# EAGLE board untitled (EAGLE 9.6.2), part 1 of 4
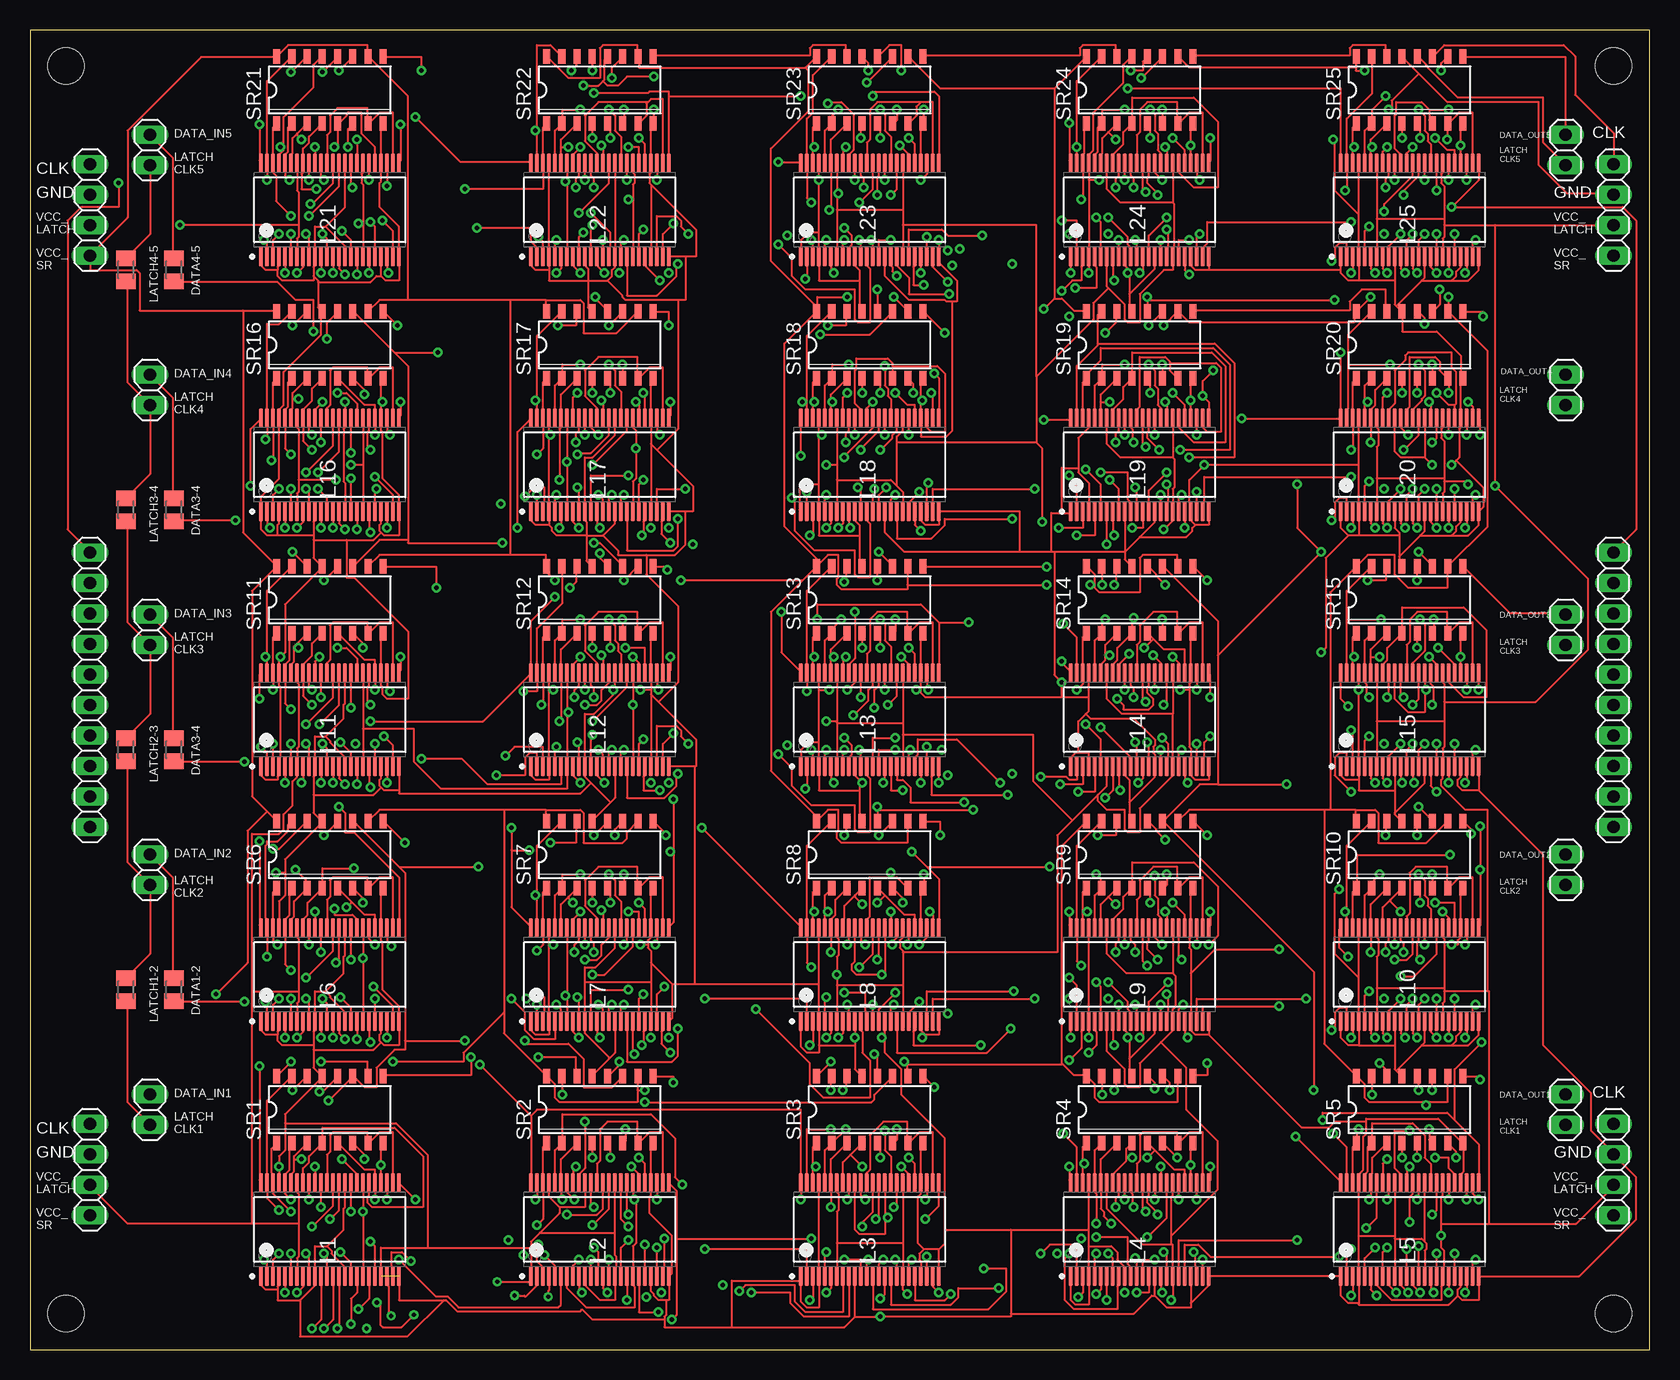
[diagram p3: board, top side]
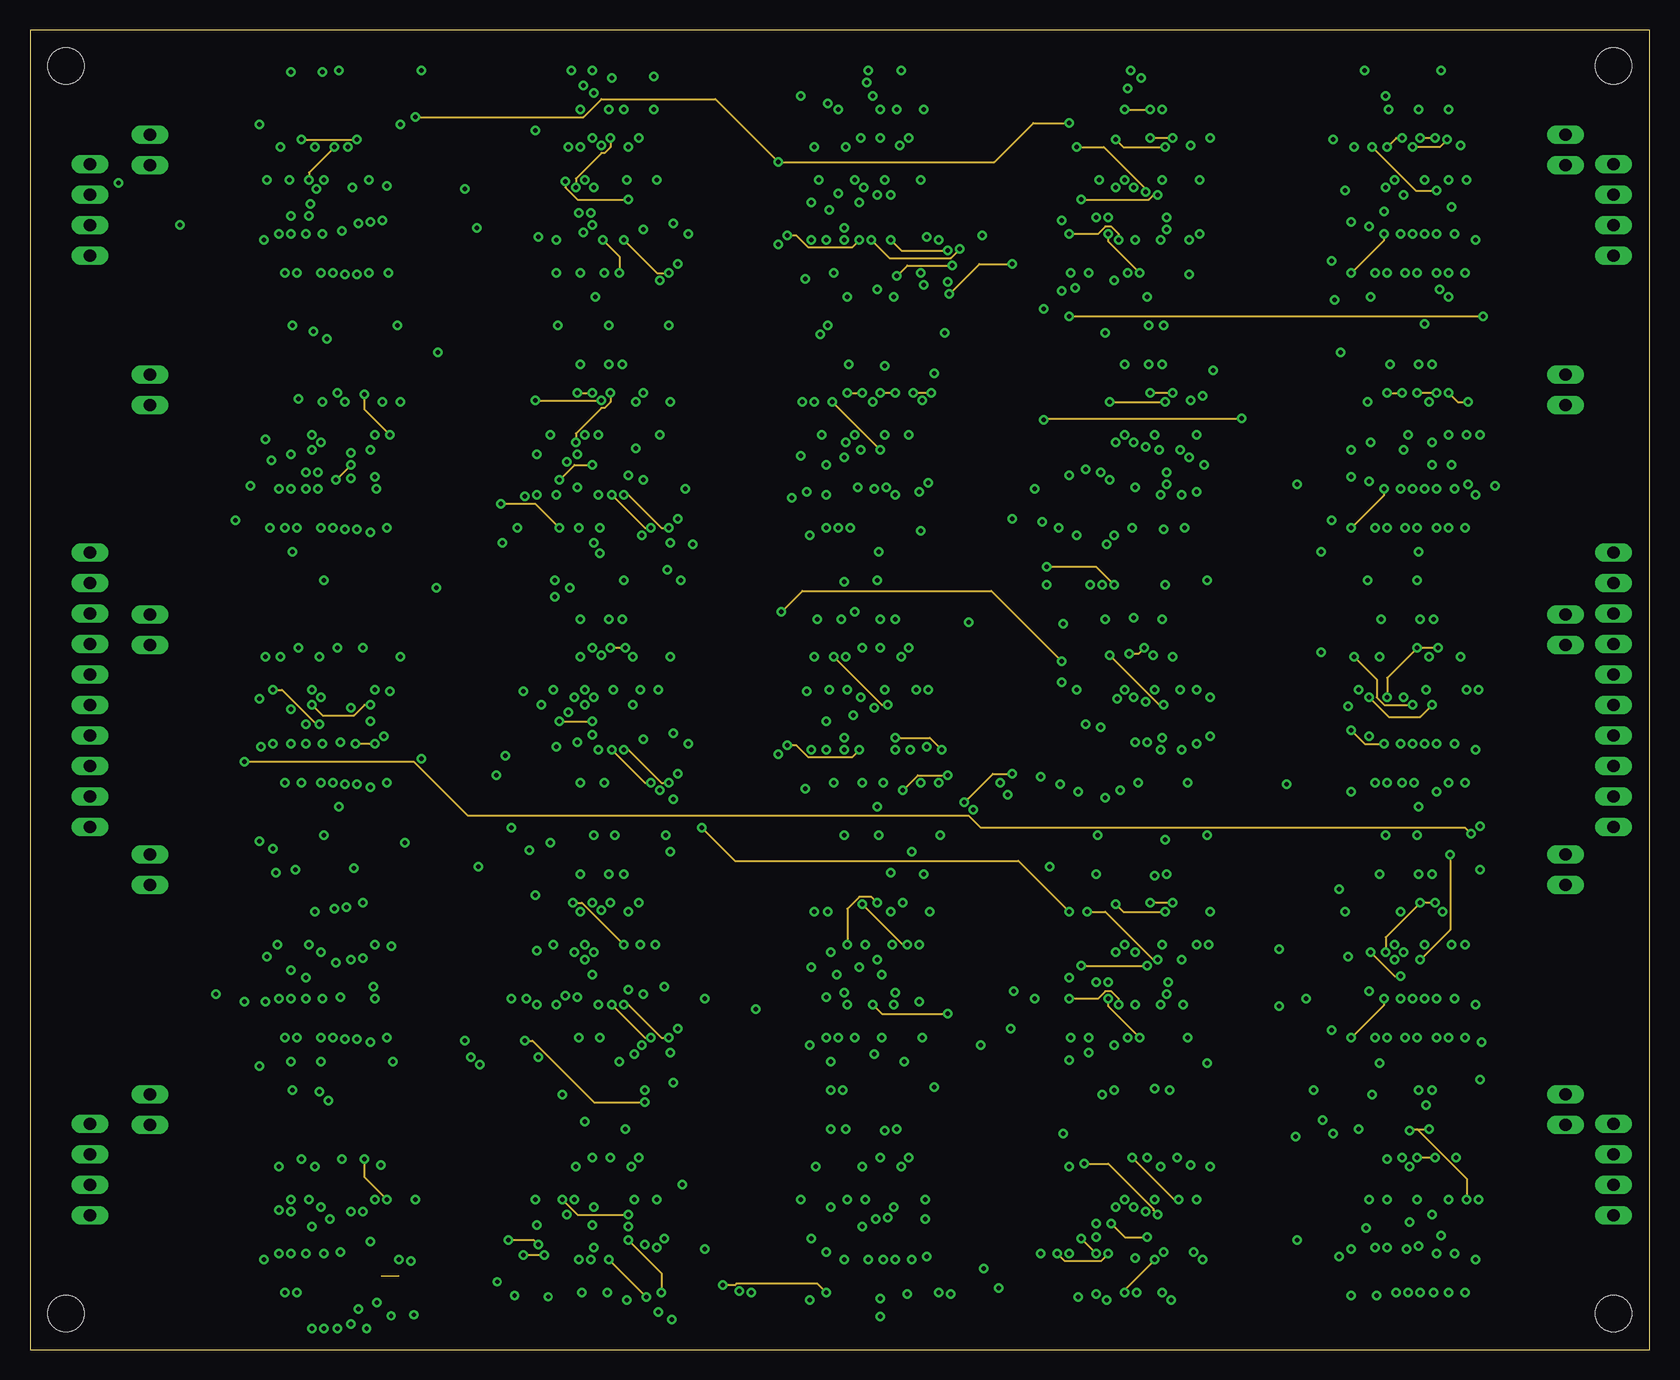
[diagram p4: board, inner layer Route2]
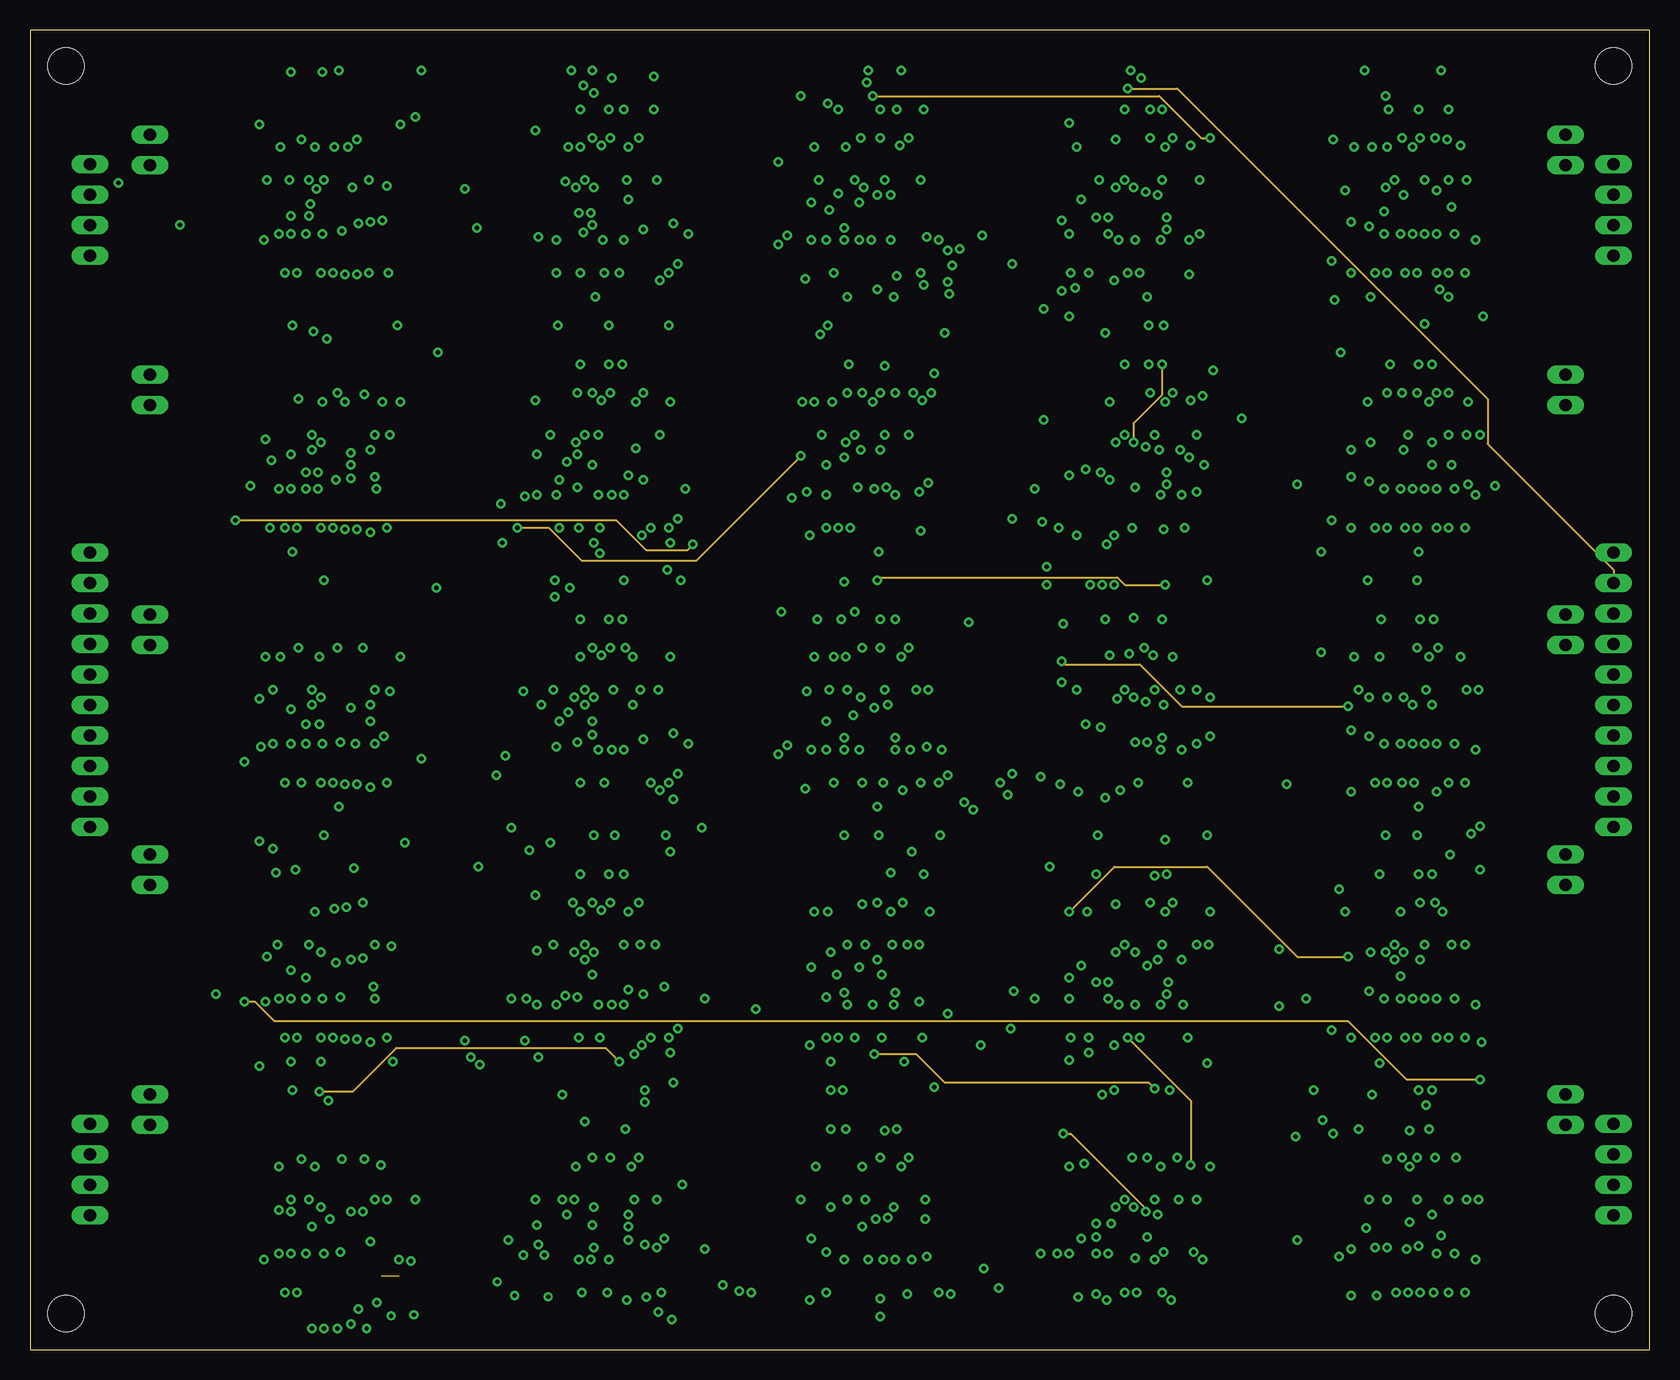
[diagram p5: board, inner layer Route15]
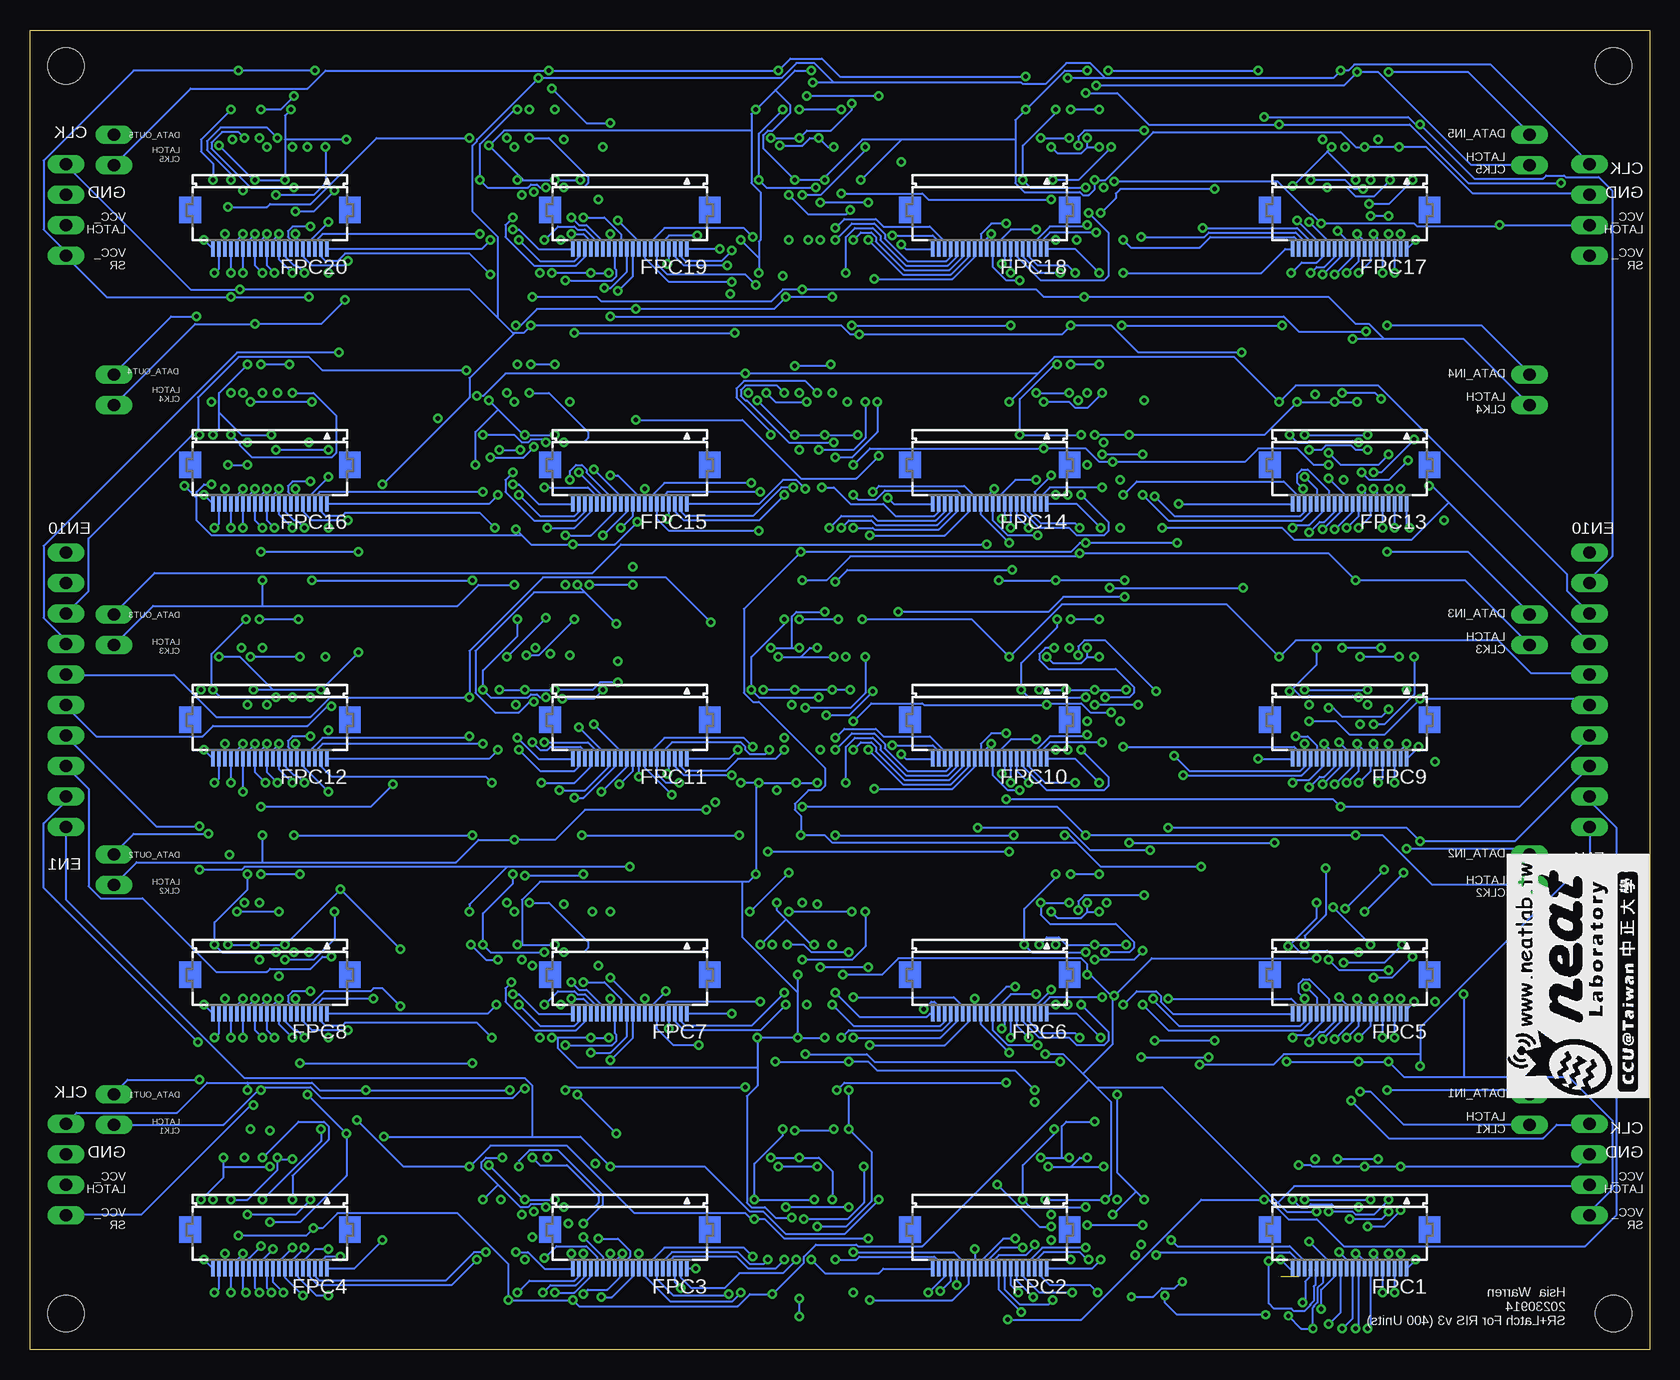
[diagram p6: board, bottom side, seen from below]

Size 135 x 110 mm. Coordinates in mm from the lower left corner, seen from the top.
Outline: 0,0 135,0 135,110 0,110 0,0
Copper layers (1+2*15+16): Top 0.035mm / dielectric 1.5mm / Route2 0.035mm / dielectric 0.15mm / Route15 0.035mm / dielectric 0.2mm / Bottom 0.035mm
Design rules "default *": minimum track width 6mil, minimum drill 0.35mm, track to track 6mil, track to pad 6mil, pad to pad 6mil, via to via 6mil, smd to smd 6mil, copper to edge 40mil, drill to drill 6mil, minimum pad ring 10mil, minimum via ring 8mil, stop-mask expansion 4mil, vias tented up to drill 0mil, thermal gap 10mil
Holes 3 mm at 3,3 132,107 3,107 132,3

## Footprints (pad centres in the part's own frame; a part is rotated, then mirrored left to right if it is on the bottom)
M0805 = smd 1.3 x 1.6: 1 -0.95,0; 2 0.95,0
1X10 = drill 1.016 long: 1 -11.43,0; 2 -8.89,0; 3 -6.35,0; 4 -3.81,0; 5 -1.27,0; 6 1.27,0; 7 3.81,0; 8 6.35,0; 9 8.89,0; 10 11.43,0
FH12-20S-0.5SH = smd 0.3 x 1.3: 1 -4.75,3.25; 2 -4.25,3.25; 3 -3.75,3.25; 4 -3.25,3.25; 5 -2.75,3.25; 6 -2.25,3.25; 7 -1.75,3.25; 8 -1.25,3.25; 9 -0.75,3.25; 10 -0.25,3.25; 11 0.25,3.25; 12 0.75,3.25; 13 1.25,3.25; 14 1.75,3.25; 15 2.25,3.25; 16 2.75,3.25; 17 3.25,3.25; 18 3.75,3.25; 19 4.25,3.25; 20 4.75,3.25
1X02 = drill 1.016 long: 1 -1.27,0; 2 1.27,0
TEXAS_INSTRUMENTS_SN74LVC16373A_2 = smd 1.6 x 0.3: 1 -3.9,5.75; 2 -3.9,5.25; 3 -3.9,4.75; 4 -3.9,4.25; 5 -3.9,3.75; 6 -3.9,3.25; 7 -3.9,2.75; 8 -3.9,2.25; 9 -3.9,1.75; 10 -3.9,1.25; 11 -3.9,0.75; 12 -3.9,0.25; 13 -3.9,-0.25; 14 -3.9,-0.75; 15 -3.9,-1.25; 16 -3.9,-1.75; 17 -3.9,-2.25; 18 -3.9,-2.75; 19 -3.9,-3.25; 20 -3.9,-3.75; 21 -3.9,-4.25; 22 -3.9,-4.75; 23 -3.9,-5.25; 24 -3.9,-5.75; 25 3.9,-5.75; 26 3.9,-5.25; 27 3.9,-4.75; 28 3.9,-4.25; 29 3.9,-3.75; 30 3.9,-3.25; 31 3.9,-2.75; 32 3.9,-2.25; 33 3.9,-1.75; 34 3.9,-1.25; 35 3.9,-0.75; 36 3.9,-0.25; 37 3.9,0.25; 38 3.9,0.75; 39 3.9,1.25; 40 3.9,1.75; 41 3.9,2.25; 42 3.9,2.75; 43 3.9,3.25; 44 3.9,3.75; 45 3.9,4.25; 46 3.9,4.75; 47 3.9,5.25; 48 3.9,5.75
1X04 = drill 1.016 long: 1 -3.81,0; 2 -1.27,0; 3 1.27,0; 4 3.81,0
SO16 = smd 0.6 x 1.2: 1 -4.445,-2.8; 2 -3.175,-2.8; 3 -1.905,-2.8; 4 -0.635,-2.8; 5 0.635,-2.8; 6 1.905,-2.8; 7 3.175,-2.8; 8 4.445,-2.8; 9 4.445,2.8; 10 3.175,2.8; 11 1.905,2.8; 12 0.635,2.8; 13 -0.635,2.8; 14 -1.905,2.8; 15 -3.175,2.8; 16 -4.445,2.8

## Placement (x,y rotation side)
CONNECTION_BETWEEN_SR5-6  0R  [M0805]  12,30 270 top
CONNECTION_BETWEEN_SR10-11  0R  [M0805]  12,50 270 top
CONNECTION_BETWEEN_SR15-16  0R  [M0805]  12,70 270 top
CONNECTION_BETWEEN_SR20-21  0R  [M0805]  12,90 270 top
EN_JP1  [1X10]  5,55 90 top
EN_JP2  [1X10]  132,55 90 top
FPC1  FH12-20S-0.5SH  [FH12-20S-0.5SH]  25,10 180 bottom
FPC2  FH12-20S-0.5SH  [FH12-20S-0.5SH]  55,10 180 bottom
FPC3  FH12-20S-0.5SH  [FH12-20S-0.5SH]  85,10 180 bottom
FPC4  FH12-20S-0.5SH  [FH12-20S-0.5SH]  115,10 180 bottom
FPC5  FH12-20S-0.5SH  [FH12-20S-0.5SH]  25,31.25 180 bottom
FPC6  FH12-20S-0.5SH  [FH12-20S-0.5SH]  55,31.25 180 bottom
FPC7  FH12-20S-0.5SH  [FH12-20S-0.5SH]  85,31.25 180 bottom
FPC8  FH12-20S-0.5SH  [FH12-20S-0.5SH]  115,31.25 180 bottom
FPC9  FH12-20S-0.5SH  [FH12-20S-0.5SH]  25,52.5 180 bottom
FPC10  FH12-20S-0.5SH  [FH12-20S-0.5SH]  55,52.5 180 bottom
FPC11  FH12-20S-0.5SH  [FH12-20S-0.5SH]  85,52.5 180 bottom
FPC12  FH12-20S-0.5SH  [FH12-20S-0.5SH]  115,52.5 180 bottom
FPC13  FH12-20S-0.5SH  [FH12-20S-0.5SH]  25,73.75 180 bottom
FPC14  FH12-20S-0.5SH  [FH12-20S-0.5SH]  55,73.75 180 bottom
FPC15  FH12-20S-0.5SH  [FH12-20S-0.5SH]  85,73.75 180 bottom
FPC16  FH12-20S-0.5SH  [FH12-20S-0.5SH]  115,73.75 180 bottom
FPC17  FH12-20S-0.5SH  [FH12-20S-0.5SH]  25,95 180 bottom
FPC18  FH12-20S-0.5SH  [FH12-20S-0.5SH]  55,95 180 bottom
FPC19  FH12-20S-0.5SH  [FH12-20S-0.5SH]  85,95 180 bottom
FPC20  FH12-20S-0.5SH  [FH12-20S-0.5SH]  115,95 180 bottom
IN_JP1  [1X02]  10,20 90 top
IN_JP2  [1X02]  10,40 90 top
IN_JP3  [1X02]  10,60 90 top
IN_JP4  [1X02]  10,80 90 top
IN_JP5  [1X02]  10,100 90 top
L1  TEXAS_INSTRUMENTS_SN74LVC16373ATEXAS_INSTRUMENTS_SN74LVC16373A_0_2  [TEXAS_INSTRUMENTS_SN74LVC16373A_2]  25,10 90 top
L2  TEXAS_INSTRUMENTS_SN74LVC16373ATEXAS_INSTRUMENTS_SN74LVC16373A_0_2  [TEXAS_INSTRUMENTS_SN74LVC16373A_2]  47.5,10 90 top
L3  TEXAS_INSTRUMENTS_SN74LVC16373ATEXAS_INSTRUMENTS_SN74LVC16373A_0_2  [TEXAS_INSTRUMENTS_SN74LVC16373A_2]  70,10 90 top
L4  TEXAS_INSTRUMENTS_SN74LVC16373ATEXAS_INSTRUMENTS_SN74LVC16373A_0_2  [TEXAS_INSTRUMENTS_SN74LVC16373A_2]  92.5,10 90 top
L5  TEXAS_INSTRUMENTS_SN74LVC16373ATEXAS_INSTRUMENTS_SN74LVC16373A_0_2  [TEXAS_INSTRUMENTS_SN74LVC16373A_2]  115,10 90 top
L6  TEXAS_INSTRUMENTS_SN74LVC16373ATEXAS_INSTRUMENTS_SN74LVC16373A_0_2  [TEXAS_INSTRUMENTS_SN74LVC16373A_2]  25,31.25 90 top
L7  TEXAS_INSTRUMENTS_SN74LVC16373ATEXAS_INSTRUMENTS_SN74LVC16373A_0_2  [TEXAS_INSTRUMENTS_SN74LVC16373A_2]  47.5,31.25 90 top
L8  TEXAS_INSTRUMENTS_SN74LVC16373ATEXAS_INSTRUMENTS_SN74LVC16373A_0_2  [TEXAS_INSTRUMENTS_SN74LVC16373A_2]  70,31.25 90 top
L9  TEXAS_INSTRUMENTS_SN74LVC16373ATEXAS_INSTRUMENTS_SN74LVC16373A_0_2  [TEXAS_INSTRUMENTS_SN74LVC16373A_2]  92.5,31.25 90 top
L10  TEXAS_INSTRUMENTS_SN74LVC16373ATEXAS_INSTRUMENTS_SN74LVC16373A_0_2  [TEXAS_INSTRUMENTS_SN74LVC16373A_2]  115,31.25 90 top
L11  TEXAS_INSTRUMENTS_SN74LVC16373ATEXAS_INSTRUMENTS_SN74LVC16373A_0_2  [TEXAS_INSTRUMENTS_SN74LVC16373A_2]  25,52.5 90 top
L12  TEXAS_INSTRUMENTS_SN74LVC16373ATEXAS_INSTRUMENTS_SN74LVC16373A_0_2  [TEXAS_INSTRUMENTS_SN74LVC16373A_2]  47.5,52.5 90 top
L13  TEXAS_INSTRUMENTS_SN74LVC16373ATEXAS_INSTRUMENTS_SN74LVC16373A_0_2  [TEXAS_INSTRUMENTS_SN74LVC16373A_2]  70,52.5 90 top
L14  TEXAS_INSTRUMENTS_SN74LVC16373ATEXAS_INSTRUMENTS_SN74LVC16373A_0_2  [TEXAS_INSTRUMENTS_SN74LVC16373A_2]  92.5,52.5 90 top
L15  TEXAS_INSTRUMENTS_SN74LVC16373ATEXAS_INSTRUMENTS_SN74LVC16373A_0_2  [TEXAS_INSTRUMENTS_SN74LVC16373A_2]  115,52.5 90 top
L16  TEXAS_INSTRUMENTS_SN74LVC16373ATEXAS_INSTRUMENTS_SN74LVC16373A_0_2  [TEXAS_INSTRUMENTS_SN74LVC16373A_2]  25,73.75 90 top
L17  TEXAS_INSTRUMENTS_SN74LVC16373ATEXAS_INSTRUMENTS_SN74LVC16373A_0_2  [TEXAS_INSTRUMENTS_SN74LVC16373A_2]  47.5,73.75 90 top
L18  TEXAS_INSTRUMENTS_SN74LVC16373ATEXAS_INSTRUMENTS_SN74LVC16373A_0_2  [TEXAS_INSTRUMENTS_SN74LVC16373A_2]  70,73.75 90 top
L19  TEXAS_INSTRUMENTS_SN74LVC16373ATEXAS_INSTRUMENTS_SN74LVC16373A_0_2  [TEXAS_INSTRUMENTS_SN74LVC16373A_2]  92.5,73.75 90 top
L20  TEXAS_INSTRUMENTS_SN74LVC16373ATEXAS_INSTRUMENTS_SN74LVC16373A_0_2  [TEXAS_INSTRUMENTS_SN74LVC16373A_2]  115,73.75 90 top
L21  TEXAS_INSTRUMENTS_SN74LVC16373ATEXAS_INSTRUMENTS_SN74LVC16373A_0_2  [TEXAS_INSTRUMENTS_SN74LVC16373A_2]  25,95 90 top
L22  TEXAS_INSTRUMENTS_SN74LVC16373ATEXAS_INSTRUMENTS_SN74LVC16373A_0_2  [TEXAS_INSTRUMENTS_SN74LVC16373A_2]  47.5,95 90 top
L23  TEXAS_INSTRUMENTS_SN74LVC16373ATEXAS_INSTRUMENTS_SN74LVC16373A_0_2  [TEXAS_INSTRUMENTS_SN74LVC16373A_2]  70,95 90 top
L24  TEXAS_INSTRUMENTS_SN74LVC16373ATEXAS_INSTRUMENTS_SN74LVC16373A_0_2  [TEXAS_INSTRUMENTS_SN74LVC16373A_2]  92.5,95 90 top
L25  TEXAS_INSTRUMENTS_SN74LVC16373ATEXAS_INSTRUMENTS_SN74LVC16373A_0_2  [TEXAS_INSTRUMENTS_SN74LVC16373A_2]  115,95 90 top
LATCH1-2  0R  [M0805]  8,30 270 top
LATCH2-3  0R  [M0805]  8,50 270 top
LATCH3-4  0R  [M0805]  8,70 270 top
LATCH4-5  0R  [M0805]  8,90 270 top
OUT_JP1  [1X02]  128,20 90 top
OUT_JP2  [1X02]  128,40 90 top
OUT_JP3  [1X02]  128,60 90 top
OUT_JP4  [1X02]  128,80 90 top
OUT_JP5  [1X02]  128,100 90 top
POWER_JP1  [1X04]  5,15 90 top
POWER_JP2  [1X04]  5,95 90 top
POWER_JP3  [1X04]  132,15 90 top
POWER_JP4  [1X04]  132,95 90 top
SR1  74HC595  [SO16]  25,20 0 top
SR2  74HC595  [SO16]  47.5,20 0 top
SR3  74HC595  [SO16]  70,20 0 top
SR4  74HC595  [SO16]  92.5,20 0 top
SR5  74HC595  [SO16]  115,20 0 top
SR6  74HC595  [SO16]  25,41.25 0 top
SR7  74HC595  [SO16]  47.5,41.25 0 top
SR8  74HC595  [SO16]  70,41.25 0 top
SR9  74HC595  [SO16]  92.5,41.25 0 top
SR10  74HC595  [SO16]  115,41.25 0 top
SR11  74HC595  [SO16]  25,62.5 0 top
SR12  74HC595  [SO16]  47.5,62.5 0 top
SR13  74HC595  [SO16]  70,62.5 0 top
SR14  74HC595  [SO16]  92.5,62.5 0 top
SR15  74HC595  [SO16]  115,62.5 0 top
SR16  74HC595  [SO16]  25,83.75 0 top
SR17  74HC595  [SO16]  47.5,83.75 0 top
SR18  74HC595  [SO16]  70,83.75 0 top
SR19  74HC595  [SO16]  92.5,83.75 0 top
SR20  74HC595  [SO16]  115,83.75 0 top
SR21  74HC595  [SO16]  25,105 0 top
SR22  74HC595  [SO16]  47.5,105 0 top
SR23  74HC595  [SO16]  70,105 0 top
SR24  74HC595  [SO16]  92.5,105 0 top
SR25  74HC595  [SO16]  115,105 0 top
U$1  [LOGO_SCALE_2.0]  0,21 90 bottom

## Tracks (layer width: path | path; a pad name or v marks a point on that pad's centre or on a via)
CLK  (via drill 0.35)
  Top 0.152: v25.75,106.62 26.88,107.75 SR21.11 | v48.5,106 48.5,106.88 49.38,107.75 SR22.11 | v69.75,105.62 71.88,107.75 SR23.11 | v92.62,106 94.38,107.75 SR24.11 | 31.25,25.75 31.25,39.75 30.75,40.25 | 31.25,25.75 31.25,25 30.38,25 28.88,23.5 28.88,21.88 27.88,21.88 27,22.75 SR1.11 26.88,22.75 v24.88,20.75 | 30.75,40.25 27,44 SR6.11 | v41.25,25.75 41.25,25.5 44.88,25.5 46.12,24.25 46.12,21.88 48.5,21.88 49.38,22.75 SR2.11 | 31.25,25.75 v36.25,25.75 | v48.75,42.88 48.75,43.38 49.38,44 SR7.11 | 30.75,40.25 v37.38,40.25 | v51.25,20.62 70.12,20.62 70.38,20.88 70.38,21.25 71.88,22.75 SR3.11 | v70.75,42.88 71.88,44 SR8.11 | v95,21.62 95,22.25 94.5,22.75 SR4.11 | v116.88,21.62 116.88,22.75 SR5.11 | 99,47.12 97.5,47.12 94.5,44.12 SR9.11 94.5,44 107,31.5 v107,21.62 | 99,57.88 99,60.75 94.5,65.25 SR14.11 | 99,57.88 99,47.12 | v115.75,45.25 116.88,44.12 SR10.11 | 99,47.12 v104.75,47.12 | v115.75,66.5 116.88,65.38 SR15.11 | 99,57.88 v107.62,66.5 105.62,68.5 v105.62,72.12 | v117.5,88.38 117.5,87.12 117,86.62 SR20.11 | SR25.11 117,107.88 117.88,108.75 127.85,108.75 128.8,107.8 128.8,104.6 132,101.4 POWER_JP4.4 | 31.5,67.5 29.12,67.5 27,65.38 SR11.11 | 31.5,67.5 31.5,82 30.38,83.12 | 30.38,83.12 27,86.5 SR16.11 | v47,67.25 47.5,67.25 49.38,65.38 SR12.11 | v39.38,67.25 31.5,67.25 31.5,67.5 | v70.75,66.5 71.88,65.38 SR13.11 | v48.25,85.38 49.38,86.5 SR17.11 | 30.38,83.12 v34,83.12 | v65.88,84.62 70,84.62 71.88,86.5 SR18.11 | v93.25,85.38 94.38,86.5 SR19.11
  Route2 0.152: v51.25,20.62 47,20.62 41.88,25.75 v41.25,25.75
  Bottom 0.152: POWER_JP2.4 5,98.88 13.25,107.12 24.62,107.12 25.12,106.62 v25.75,106.62 26.38,106 45.38,106 | 45.38,106 v48.5,106 | 68,105.62 52.38,105.62 52.25,105.5 50.38,105.5 48.62,107.25 46.62,107.25 45.38,106 | 68,105.62 v69.75,105.62 | 68,105.62 69.62,107.25 71.12,107.25 72.38,106 v92.62,106 97.75,100.88 97.75,100.75 98.12,100.38 98.12,94.88 96,92.75 96,86 | v36.25,25.75 v41.25,25.75 | v48.75,42.88 48.38,42.88 47.75,42.25 | 47.75,42.25 45.75,40.25 v37.38,40.25 | 47.75,42.25 68.12,42.25 68.75,42.88 v70.75,42.88 70.75,44.5 71.25,45 71.25,45.5 70.12,46.62 69.12,46.62 68.75,47 68.75,48.5 74.25,54 74.75,54 75.5,54.75 75.5,61.75 v70.75,66.5 48.25,66.5 47.5,67.25 v47,67.25 v39.38,67.25 | v24.88,20.75 21.75,17.62 8.88,17.62 7.75,18.75 5,18.75 POWER_JP1.4 | v95,21.62 v107,21.62 110.88,21.62 111.5,22.25 116.88,22.25 | 116.88,22.25 120.25,22.25 122.75,19.75 131.12,19.75 132,18.88 POWER_JP3.4 | 116.88,22.25 v116.88,21.62 | v115.75,45.25 106.62,45.25 v104.75,47.12 | v107.62,66.5 v115.75,66.5 | POWER_JP4.4 132,98.75 121.62,88.38 v117.5,88.38 98.38,88.38 96,86 | v34,83.12 42.62,83.12 44.88,85.38 v48.25,85.38 49,84.62 v65.88,84.62 66.62,84.62 67.38,85.38 v93.25,85.38 93.88,84.75 94.62,84.75 | 96,86 94.75,84.75 94.62,84.75 | v105.62,72.12 98.38,79.38 98.38,81 94.62,84.75
DATA_IN1  (via drill 0.35)
  Top 0.152: v21.88,21.62 23,22.75 SR1.14
  Bottom 0.152: v21.88,21.62 10.25,21.62 10,21.38 IN_JP1.2
DATA_IN2  (via drill 0.35)
  Top 0.152: v20.25,41.75 20.75,41.75 23,44 SR6.14 | CONNECTION_BETWEEN_SR5-6.1 12,31 11.88,31.12 11.88,39.38 10,41.25 IN_JP2.2
  Bottom 0.152: v20.25,41.75 10.38,41.75 10,41.38 IN_JP2.2
DATA_IN3  (via drill 0.35)
  Top 0.152: v21.88,66.5 23,65.38 SR11.14 | CONNECTION_BETWEEN_SR10-11.1 12,51 11.88,51.12 11.88,59.38 10,61.25 IN_JP3.2
  Bottom 0.152: v21.88,66.5 15.12,66.5 10,61.38 IN_JP3.2
DATA_IN4  (via drill 0.35)
  Top 0.152: v21.88,85.38 23,86.5 SR16.14 | CONNECTION_BETWEEN_SR15-16.1 12,71 11.88,71.12 11.88,79.38 10,81.25 IN_JP4.2
  Bottom 0.152: v21.88,85.38 14,85.38 10,81.38 IN_JP4.2
DATA_IN5  (via drill 0.35)
  Top 0.152: v21.75,106.5 23,107.75 SR21.14 | CONNECTION_BETWEEN_SR20-21.1 12,91 11.88,91.12 11.88,99.38 10,101.25 IN_JP5.2
  Bottom 0.152: v21.75,106.5 15.12,106.5 10,101.38 IN_JP5.2
DATA_OUT1  (via drill 0.35)
  Top 0.152: v120.88,22.5 120.88,22.75 119.5,22.75 SR5.9 | v17.88,29 12,29 CONNECTION_BETWEEN_SR5-6.2
  Route15 0.152: v17.88,29 18.75,29 20.38,27.38 109.88,27.38 114.75,22.5 v120.88,22.5
  Bottom 0.152: v120.88,22.5 126.88,22.5 128,21.38 OUT_JP1.2
DATA_OUT2  (via drill 0.35)
  Top 0.152: v120.12,43 120.12,43.38 119.5,44 SR10.9 | v17.88,49 12,49 CONNECTION_BETWEEN_SR10-11.2
  Route2 0.152: v17.88,49 32,49 36.5,44.5 78.25,44.5 79.25,43.5 119.62,43.5 v120.12,43
  Bottom 0.152: v120.12,43 126.38,43 128,41.38 OUT_JP2.2
DATA_OUT3  (via drill 0.35)
  Top 0.152: SR15.9 119.5,65.25 123.38,61.38 128,61.38 OUT_JP3.2 | v17.12,69.12 12,69.12 CONNECTION_BETWEEN_SR15-16.2
  Route15 0.152: v17.12,69.12 48.88,69.12 51.38,66.62 54.75,66.62 v55.25,67.12
  Bottom 0.152: v55.25,67.12 85.75,67.12 88.12,64.75 124.62,64.75 128,61.38 OUT_JP3.2
DATA_OUT4  (via drill 0.35)
  Top 0.152: v121.12,86.12 121.12,86.5 119.5,86.5 SR20.9 | v23.62,84.88 23.62,87.5 22.12,87.5 20.62,89 12,89 CONNECTION_BETWEEN_SR20-21.2
  Route2 0.152: v121.12,86.12 v86.62,86.12
  Bottom 0.152: v121.12,86.12 123.25,86.12 128,81.38 OUT_JP4.2 | v23.62,84.88 29.25,84.88 30.5,86.12 v86.62,86.12
DATA_OUT5
  Top 0.152: OUT_JP5.2 128,107.75 119.5,107.75 SR25.9
EN1  (via drill 0.35)
  Top 0.152: v86.62,15.25 86.62,14.12 86.75,14 L4.48 | v105.5,17.75 109.25,14 L5.48 | 41.75,19.5 L2.48 | 41.75,19.5 42.25,20 64.25,20 L3.48 v64.25,12.5 | v19.12,23.62 19.12,14.12 19.25,14 L1.48 | v37.5,23.75 41.75,19.5
  Bottom 0.152: v105.5,17.75 93.12,17.75 | 93.12,17.75 89.12,17.75 v86.62,15.25 78.75,15.25 75,11.5 73.88,11.5 72,9.62 67.12,9.62 v64.25,12.5 | EN_JP2.1 132,37.5 117.12,22.62 93.75,22.62 93.12,22 93.12,17.75 | 19.12,24.62 19.12,26.88 5,41 EN_JP1.1 | 19.12,24.62 v19.12,23.62 | v37.5,23.75 31.38,23.75 30.5,24.62 19.12,24.62
EN2  (via drill 0.35)
  Top 0.152: v32.12,12.5 30.75,13.88 L1.25 | v53.5,2.5 53.88,2.88 53.88,9.25 | 53.88,9.25 53.88,13.25 53.25,13.88 L2.25 | L3.25 75.75,12 v74.62,10.88 | 53.88,9.25 v65.12,9.25 | v98.38,15.25 98.38,14.12 98.25,14 L4.25 | L5.25 120.75,17.12 118.75,19.12 | 118.75,19.12 118.12,19.75 107.75,19.75 v107.75,19.12 | v121,25.62 118.75,23.38 118.75,19.12
  Bottom 0.152: v53.5,2.5 47.38,2.5 37.38,12.5 v32.12,12.5 31.75,12.5 30.12,10.88 27.75,10.88 25.5,8.62 5.38,8.62 2.75,11.25 2.75,43.5 5,45.75 EN_JP1.2 | v65.12,9.25 72.12,9.25 73.75,10.88 v74.62,10.88 74.88,10.88 75.38,11.38 84.62,11.38 90.25,17 96.62,17 v98.38,15.25 103.88,15.25 v107.75,19.12 | EN_JP2.2 132,45.75 133.88,43.88 133.88,38.5 v121,25.62
EN3  (via drill 0.35)
  Top 0.152: v109.88,32.75 109.12,33.5 109.12,35 109.25,35.12 L10.48 | v19.12,42.38 19.12,35.38 19.25,35.25 L6.48 | v40.12,43.5 40.12,41.62 | 40.12,41.62 40.12,36.88 41.75,35.25 L7.48 | v56,43.5 64.25,35.25 L8.48 | 40.12,41.62 v41.62,41.62 | v86.62,36.5 86.62,35.38 86.75,35.25 L9.48
  Route2 0.152: v86.62,36.5 82.38,40.75 58.75,40.75 v56,43.5
  Route15 0.152: v109.88,32.75 105.62,32.75 98.12,40.25 90.38,40.25 v86.62,36.5
  Bottom 0.152: v109.88,32.75 110.62,32.75 111.62,31.75 115,31.75 115.25,31.5 119.5,31.5 125.62,37.62 129.12,37.62 130.12,38.62 130.12,46.75 132,48.62 EN_JP2.3 | EN_JP1.3 5,48.62 11.25,42.38 v19.12,42.38 20.25,43.5 v40.12,43.5 | v56,43.5 48.5,43.5 46.62,41.62 v41.62,41.62
EN4  (via drill 0.35)
  Top 0.152: v120.88,43.62 v120.88,40 120.88,35.38 120.75,35.25 L10.25 | L6.25 30.75,39.38 27,43.12 26.25,43.12 26.25,44.75 v25.75,45.25 | v53.62,45.88 53.62,41.5 | 53.62,41.5 53.62,35.62 53.25,35.25 L7.25 | L8.25 75.75,39.25 74.75,40.25 | v73.5,41.5 74.75,40.25 | 53.62,41.5 v53.38,41.5 | v98.38,36.5 98.38,35.38 98.25,35.25 L9.25 | 74.75,40.25 v85,40.25
  Bottom 0.152: v120.88,43.62 124.5,43.62 132,51.12 EN_JP2.4 | EN_JP1.4 5,51.12 10.88,45.25 v25.75,45.25 26.38,45.88 v53.62,45.88 | v53.38,41.5 v73.5,41.5 | v98.38,36.5 98.38,37.12 95.25,40.25 | v85,40.25 95.25,40.25 | v120.88,40 117.38,40 117.12,40.25 95.25,40.25
EN5  (via drill 0.35)
  Top 0.152: L15.48 109.25,54.25 v109.88,53.62 | v19.12,54.25 19.12,56.25 19.25,56.38 L11.48 | v28.38,52.38 37.75,52.38 41.75,56.38 L12.48 41.75,60.75 v43.75,62.75 | v62.62,61.5 62.62,58.12 64.25,56.5 L13.48 | v86,57.38 86,57.25 86.75,56.5 L14.48
  Route2 0.152: v86,57.38 80.12,63.25 64.38,63.25 v62.62,61.5
  Route15 0.152: v109.88,53.62 96,53.62 92.5,57.12 86.25,57.12 v86,57.38
  Bottom 0.152: v109.88,53.62 110.25,53.62 111.88,52 119.75,52 120.62,51.12 129.5,51.12 132,53.62 EN_JP2.5 | EN_JP1.5 5,53.75 5.5,54.25 v19.12,54.25 22.12,51.25 25,51.25 26.12,52.38 v28.38,52.38 | v62.62,61.5 50.12,61.5 48.88,62.75 v43.75,62.75
EN6  (via drill 0.35)
  Top 0.152: v98.38,54.38 98.38,56.25 98.25,56.38 L14.25 | v120.75,55 L15.25 | v30.88,57.75 30.88,56.62 30.75,56.5 L11.25 | v53.38,57.75 53.38,56.62 53.25,56.5 L12.25 | 75.75,60.62 L13.25 | 75.75,60.62 74.25,62.12 65.62,62.12 v65.62,60.88 | 75.75,60.62 v78.25,60.62
  Bottom 0.152: 121.25,54.5 123,56.25 132,56.25 EN_JP2.6 | 121.25,54.5 119.5,52.75 111.62,52.75 110,54.38 v98.38,54.38 98.38,58.25 92.25,64.38 82,64.38 v78.25,60.62 | 121.25,54.5 v120.75,55 | EN_JP1.6 5,56.38 9.88,56.38 12.62,59.12 29.5,59.12 v30.88,57.75 35.25,62.12 49,62.12 v53.38,57.75 56.5,60.88 v65.62,60.88
EN7  (via drill 0.35)
  Top 0.152: v18.38,72 18.38,76.75 19.25,77.62 L16.48 | v40.62,68.5 40.62,76.5 41.75,77.62 L17.48 | v64.25,74.5 L18.48 | v84.5,77.5 86.75,77.5 L19.48 | v101,77.62 109.25,77.62 L20.48 v109.25,83.12
  Route2 0.152: v101,77.62 84.62,77.62 v84.5,77.5
  Route15 0.152: v40.62,68.5 43.25,68.5 46,65.75 55.5,65.75 v64.25,74.5
  Bottom 0.152: v18.38,72 18.12,72 16.75,70.62 | 16.75,70.62 5,58.88 EN_JP1.7 | v40.62,68.5 30.62,68.5 29.62,67.5 19.88,67.5 16.75,70.62 | v64.25,74.5 66.12,72.62 70.75,72.62 75.62,77.5 v84.5,77.5 | EN_JP2.7 132,59.12 133.88,61 133.88,67 117.75,83.12 v109.25,83.12
EN8  (via drill 0.35)
  Top 0.152: v120.88,76.25 120.88,77.5 120.75,77.62 L20.25 | v30.88,79 30.88,77.88 30.75,77.75 L16.25 | v53.38,79 53.38,77.88 53.25,77.75 L17.25 | L18.25 75.75,81 v75.38,81.38 | L19.25 98.25,79 v97.75,79.5 97.75,80.75 v98.62,81.62
  Bottom 0.152: 121,76.25 121.5,76.25 130.12,67.62 130.12,63.25 132,61.38 EN_JP2.8 | EN_JP1.8 5,61.38 6.88,63.25 6.88,64.62 22.62,80.38 29.5,80.38 v30.88,79 34.62,82.75 49.62,82.75 51,81.38 | 51,81.38 v53.38,79 | 51,81.38 v75.38,81.38 95.38,81.38 97.25,79.5 v97.75,79.5 | 121,76.25 121,79.38 117.62,82.75 111.75,82.75 110.62,81.62 v98.62,81.62 | 121,76.25 v120.88,76.25
EN9  (via drill 0.35)
  Top 0.152: v86.62,102.25 86.62,99.12 86.75,99 L24.48 | v91.5,105.12 109.25,105.12 L25.48 | v19.12,102.12 19.12,99.12 19.25,99 L21.48 | v32.12,102.75 35.88,99 41.75,99 L22.48 | v62.38,99 64.25,99 L23.48
  Route2 0.152: v32.12,102.75 46.12,102.75 47.62,104.25 57.12,104.25 v62.38,99 80.38,99 83.62,102.25 v86.62,102.25
  Route15 0.152: EN_JP2.9 132,65 121.5,75.5 121.5,79.25 95.62,105.12 v91.5,105.12
  Bottom 0.152: v86.62,102.25 88.62,102.25 v91.5,105.12 | v32.12,102.75 20.12,102.75 19.5,102.12 v19.12,102.12 14.62,97.62 8.88,97.62 8.62,97.88 7.12,97.88 7,97.75 4.25,97.75 3.12,96.62 3.12,66.12 5,64.25 EN_JP1.9
EN10  (via drill 0.35)
  Top 0.152: v98.38,101 98.38,99.12 98.25,99 L24.25 | L25.25 120.75,97.5 v118.5,95.25 132.75,95.25 133.88,94.12 133.88,68.38 132,66.5 EN_JP2.10 | v30.88,102.12 30.88,99.12 30.75,99 L21.25 | v47,104.75 51.5,104.75 51.62,104.88 53.25,104.88 53.25,104.5 | L22.25 53.25,104.5 | L23.25 75.75,104.5 75.38,104.88 70.25,104.88 v70.25,104.5 | 53.25,104.5 v64.25,104.5 | v7.38,97.25 7.38,95.25 4.25,95.25 3.12,94.12 3.12,68.38 5,66.5 EN_JP1.10
  Route15 0.152: v98.38,101 97.62,101 94.12,104.5 v70.25,104.5
  Bottom 0.152: v98.38,101 106.12,101 111.62,95.5 115,95.5 115.25,95.25 v118.5,95.25 | v47,104.75 44.38,104.75 41.75,102.12 v30.88,102.12 20,102.12 15.12,97.25 v7.38,97.25 | v64.25,104.5 v70.25,104.5
FPC1_1  (via drill 0.35)
  Top 0.152: v19.5,7.5 19.75,7.25 L1.2
  Bottom 0.152: v19.5,7.5 FPC1.1
FPC1_2  (via drill 0.35)
  Top 0.152: v20.75,8 20.25,7.5 L1.3
  Bottom 0.152: v20.75,8 FPC1.2
FPC1_3  (via drill 0.35)
  Top 0.152: L1.5 v21.25,4.75
  Bottom 0.152: v21.25,4.75 FPC1.3
FPC1_4  (via drill 0.35)
  Top 0.152: L1.6 v21.75,8
  Bottom 0.152: v21.75,8 FPC1.4
FPC1_5  (via drill 0.35)
  Top 0.152: v22.25,4.75 22.75,5.25 L1.8
  Bottom 0.152: v22.25,4.75 FPC1.5
FPC1_6  (via drill 0.35)
  Top 0.152: v23,8 23.25,7.75 L1.9
  Bottom 0.152: FPC1.6 22.75,7.75 v23,8
FPC1_7  (via drill 0.35)
  Top 0.152: v23.5,1.75 24.25,2.5 L1.11
  Bottom 0.152: FPC1.7 23.25,2 v23.5,1.75
FPC1_8  (via drill 0.35)
  Top 0.152: v24.5,8 24.75,7.75 L1.12
  Bottom 0.152: FPC1.8 23.75,7.38 24.38,8 v24.5,8
FPC1_9  (via drill 0.35)
  Top 0.152: v24.5,1.75 25.25,2.5 L1.13
  Bottom 0.152: FPC1.9 24.25,2 v24.5,1.75
FPC1_10  (via drill 0.35)
  Top 0.152: v25.62,1.75 25.75,1.88 L1.14
  Bottom 0.152: FPC1.10 24.75,2.62 v25.62,1.75
FPC1_11  (via drill 0.35)
  Top 0.152: v25.88,8.12 26.75,7.25 L1.16
  Bottom 0.152: FPC1.11 25.25,7.5 v25.88,8.12
FPC1_12  (via drill 0.35)
  Top 0.152: L1.17 27.25,4.75 26.75,4.25 v26.75,2.12
  Bottom 0.152: FPC1.12 25.75,3.12 v26.75,2.12
FPC1_13  (via drill 0.35)
  Top 0.152: v27.38,3.38 28.25,4.25 L1.19
  Bottom 0.152: FPC1.13 26.25,6.12 27.38,5 v27.38,3.38
FPC1_14  (via drill 0.35)
  Top 0.152: v28.38,9 28.75,8.62 L1.20
  Bottom 0.152: FPC1.14 26.75,7.38 v28.38,9
FPC1_15  (via drill 0.35)
  Top 0.152: L1.22 29.87,5.98 29.87,5.26 29.9,5.24 29.9,2.9 30,2.8 v30.1,2.8
  Bottom 0.152: FPC1.15 27.25,5.56 27.68,5.13 27.68,3.93 27.98,3.63 27.98,3.57 28.05,3.5 v28.05,1.75 29.05,1.75 v30.1,2.8
FPC1_16  (via drill 0.35)
  Top 0.152: v31.75,7.38 31,8.12 30.12,8.12 30.12,7 30.25,6.88 L1.23
  Bottom 0.152: 27.75,6.12 FPC1.16 27.87,6.63 27.87,5.37 27.98,5.25 27.98,4.05 28.29,3.75 28.29,3.69 28.79,3.19 29.63,3.19 29.85,3.41 31.31,3.41 31.75,3.85 v31.75,7.38
FPC1_17  (via drill 0.35)
  Top 0.152: v28.92,3.92 29.19,3.65 29.19,2.42 29.2,2.42 29.2,2.07 29.4,1.87 30.97,1.87 v32,2.9 | v40.4,4.5 41.2,4.5 41.3,4.4 42.3,5.4 42.3,6.05 L2.2
  Bottom 0.152: FPC1.17 28.37,6.63 28.37,6 28.7,5.68 28.7,4.14 v28.92,3.92 | v40.4,4.5 40.4,3.9 39.4,2.9 v32,2.9
FPC1_18  (via drill 0.35)
  Top 0.152: v42.38,8.75 42.25,8.62 42.25,7.38 42.75,6.88 L2.3
  Route2 0.152: v39.88,9.12 42,9.12 v42.38,8.75
  Bottom 0.152: FPC1.18 28.75,7.38 30,8.62 39.38,8.62 v39.88,9.12
FPC1_19  (via drill 0.35)
  Top 0.152: v42.88,7.88 43.75,7 L2.5
  Route2 0.152: v42.88,7.88 v41.12,7.88
  Bottom 0.152: FPC1.19 29.25,7.38 30,8.12 40.88,8.12 v41.12,7.88
FPC1_20  (via drill 0.35)
  Top 0.152: v30.75,7.5 33.82,4.43 34.8,4.43 35.72,3.52 44.02,3.52 44.25,3.75 L2.6
  Bottom 0.152: FPC1.20 30,6.75 v30.75,7.5
FPC2_1  (via drill 0.35)
  Top 0.152: v45.75,7.5 45.25,7 L2.8
  Bottom 0.152: FPC2.1 46.5,6.75 v45.75,7.5
FPC2_2  (via drill 0.35)
  Top 0.152: v46,4.75 45.75,5 L2.9
  Bottom 0.152: FPC2.2 50.75,6.12 50,5.38 46.62,5.38 v46,4.75
FPC2_3  (via drill 0.35)
  Top 0.152: L2.11 v46.75,7.5
  Bottom 0.152: FPC2.3 51.25,7.38 50.5,8.12 47.5,8.12 46.88,7.5 v46.75,7.5
FPC2_4  (via drill 0.35)
  Top 0.152: v47,8.5 47.38,8.12 47.38,7 47.25,6.88 L2.12
  Bottom 0.152: FPC2.4 51.75,7.38 50.62,8.5 v47,8.5
FPC2_5  (via drill 0.35)
  Top 0.152: v48.12,4.75 47.75,5.12 L2.13
  Bottom 0.152: FPC2.5 52.25,6.12 50.88,4.75 v48.12,4.75
FPC2_6  (via drill 0.35)
  Top 0.152: L2.14 v48.25,7.5
  Route2 0.152: v48.25,7.5 v51.38,4.38
  Bottom 0.152: FPC2.6 52.75,5.75 v51.38,4.38
FPC2_7  (via drill 0.35)
  Top 0.152: v49.88,9.12 49.25,8.5 L2.16
  Route2 0.152: v52.62,4.75 52.62,6.38 v49.88,9.12
  Bottom 0.152: FPC2.7 53.25,5.38 v52.62,4.75
FPC2_8  (via drill 0.35)
  Top 0.152: L2.17 v49.75,4.12
  Bottom 0.152: FPC2.8 53.75,5 52.5,3.75 50.12,3.75 v49.75,4.12
FPC2_9  (via drill 0.35)
  Top 0.152: v52.38,3.12 50.75,3.12 L2.19
  Bottom 0.152: FPC2.9 54.25,5 v52.38,3.12
FPC2_10  (via drill 0.35)
  Top 0.152: L2.20 v51.25,8.75
  Bottom 0.152: FPC2.10 54.75,7.38 54.25,7.88 52,7.88 51.25,8.62 v51.25,8.75
FPC2_11  (via drill 0.35)
  Top 0.152: L2.22 v52.25,8.5
  Bottom 0.152: FPC2.11 55.25,7.38 54.12,8.5 v52.25,8.5
FPC2_12  (via drill 0.35)
  Top 0.152: v52.88,9.25 52.88,7 52.75,6.88 L2.23
  Bottom 0.152: FPC2.12 55.75,7.38 53.88,9.25 v52.88,9.25
FPC2_13  (via drill 0.35)
  Top 0.152: v56.25,8.38 64.75,8.38 L3.2
  Bottom 0.152: v56.25,8.38 FPC2.13
FPC2_14  (via drill 0.35)
  Top 0.152: v65,4.12 65.25,4.38 L3.3
  Bottom 0.152: FPC2.14 56.75,5.5 58.12,4.12 v65,4.12
FPC2_15  (via drill 0.35)
  Top 0.152: v66.38,8.12 66.25,8 L3.5
  Bottom 0.152: FPC2.15 57.25,7.38 58,8.12 v66.38,8.12
FPC2_16  (via drill 0.35)
  Top 0.152: v66.38,4.75 66.75,5.12 L3.6
  Route2 0.152: v57.75,5.38 58.75,5.38 58.88,5.5 65.62,5.5 v66.38,4.75
  Bottom 0.152: v57.75,5.38 FPC2.16
FPC2_17  (via drill 0.35)
  Top 0.152: v59.12,4.88 59.62,5.38 63.75,5.38 63.75,4 64.62,3.12 67.75,3.12 L3.8
  Bottom 0.152: FPC2.17 58.25,5.75 v59.12,4.88
FPC2_18  (via drill 0.35)
  Top 0.152: v60.12,4.75 63.38,4.75 63.38,3.88 64.5,2.75 68.25,2.75 L3.9
  Bottom 0.152: FPC2.18 58.75,6.12 v60.12,4.75
FPC2_19  (via drill 0.35)
  Top 0.152: v67.88,7.5 69.25,7.5 L3.11
  Bottom 0.152: FPC2.19 59.25,7.38 59.62,7.75 65.88,7.75 66.12,7.5 v67.88,7.5
FPC2_20  (via drill 0.35)
  Top 0.152: v69.88,7.5 69.75,7.38 L3.12
  Bottom 0.152: FPC2.20 63.88,6.75 64.25,6.38 68.75,6.38 v69.88,7.5
FPC3_1  (via drill 0.35)
  Top 0.152: v79.5,6.75 81.38,6.75 81.38,4.88 79.88,3.38 70.25,3.38 L3.13
  Bottom 0.152: v79.5,6.75 FPC3.1
FPC3_2  (via drill 0.35)
  Top 0.152: v71.12,7.5 70.75,7.12 L3.14
  Bottom 0.152: FPC3.2 80.75,6 79.88,5.12 77.12,5.12 75.88,6.38 72.25,6.38 v71.12,7.5
FPC3_3  (via drill 0.35)
  Top 0.152: v80.75,5.12 77.38,5.12 77.38,4.38 76.75,3.75 71.75,3.75 L3.16
  Bottom 0.152: FPC3.3 81.25,5.62 v80.75,5.12
FPC3_4  (via drill 0.35)
  Top 0.152: v72.12,7.5 72.25,7.38 L3.17
  Bottom 0.152: FPC3.4 81.75,7.38 81.38,7.75 76.12,7.75 75.12,6.75 72.88,6.75 v72.12,7.5
FPC3_5  (via drill 0.35)
  Top 0.152: v73.5,7.5 73.25,7.25 L3.19
  Bottom 0.152: FPC3.5 82.25,7.38 81.5,8.12 76,8.12 75,7.12 73.88,7.12 v73.5,7.5
FPC3_6  (via drill 0.35)
  Top 0.152: v76.75,4.62 76.25,4.12 73.75,4.12 L3.20
  Bottom 0.152: FPC3.6 82.75,5.88 81.38,4.5 76.88,4.5 v76.75,4.62
FPC3_7  (via drill 0.35)
  Top 0.152: L3.22 v74.75,7.75
  Bottom 0.152: FPC3.7 83.25,7.38 82.12,8.5 75.5,8.5 v74.75,7.75
FPC3_8  (via drill 0.35)
  Top 0.152: v75.75,4.75 75.25,5.25 L3.23
  Bottom 0.152: FPC3.8 83.75,6.12 81.62,4 76.5,4 v75.75,4.75
FPC3_9  (via drill 0.35)
  Top 0.152: v84.25,8 85,8.75 87.25,8.75 L4.2
  Bottom 0.152: v84.25,8 FPC3.9
FPC3_10  (via drill 0.35)
  Top 0.152: v87.38,4.38 87.75,4.75 L4.3
  Bottom 0.152: FPC3.10 84.75,6.12 86.5,4.38 v87.38,4.38
FPC3_11  (via drill 0.35)
  Top 0.152: v88.88,8 88.75,7.88 L4.5
  Route2 0.152: v88.88,8 v87.62,9.25
  Bottom 0.152: FPC3.11 85.25,7.5 85,7.75 85,8.25 86,9.25 v87.62,9.25
FPC3_12  (via drill 0.35)
  Top 0.152: v88.88,4.62 89.25,5 L4.6
  Bottom 0.152: FPC3.12 85.75,6.12 86.88,5 88.5,5 v88.88,4.62
FPC3_13  (via drill 0.35)
  Top 0.152: v89.88,8 90.25,7.62 L4.8
  Route2 0.152: v85.62,8 86.25,7.38 89.25,7.38 v89.88,8
  Bottom 0.152: FPC3.13 86.25,7.38 v85.62,8
FPC3_14  (via drill 0.35)
  Top 0.152: v86.62,8 86.25,7.62 86.25,4.12 87,3.38 90.62,3.38 90.62,5.25 90.75,5.38 L4.9
  Bottom 0.152: FPC3.14 86.75,7.88 v86.62,8
FPC3_15  (via drill 0.35)
  Top 0.152: v88.88,9.38 91.5,9.38 91.5,7.12 91.75,6.88 L4.11
  Bottom 0.152: FPC3.15 87.25,7.75 v88.88,9.38
FPC3_16  (via drill 0.35)
  Top 0.152: v92.12,7.62 92.25,7.5 L4.12
  Bottom 0.152: FPC3.16 87.75,7.75 88.62,8.62 91.12,8.62 v92.12,7.62
FPC3_17  (via drill 0.35)
  Top 0.152: v93.75,7.5 92.75,7.5 L4.13
  Route2 0.152: v91.25,4.75 91.25,5 v93.75,7.5
  Bottom 0.152: FPC3.17 88.25,6.12 89.62,4.75 v91.25,4.75
FPC3_18  (via drill 0.35)
  Top 0.152: v92.25,4.75 93.25,4.75 L4.14
  Bottom 0.152: FPC3.18 88.75,6.12 89.5,5.38 91.62,5.38 v92.25,4.75
FPC3_19  (via drill 0.35)
  Top 0.152: v94.38,4.75 94.25,4.88 L4.16
  Bottom 0.152: FPC3.19 89.25,6.12 89.62,5.75 93.38,5.75 v94.38,4.75
FPC3_20  (via drill 0.35)
  Top 0.152: v94.5,8.12 94.75,7.88 L4.17
  Bottom 0.152: FPC3.20 92.12,6.75 93.5,8.12 v94.5,8.12
FPC4_1  (via drill 0.35)
  Top 0.152: v105.62,9.12 95.75,9.12 L4.19
  Bottom 0.152: FPC4.1 108,6.75 v105.62,9.12
FPC4_2  (via drill 0.35)
  Top 0.152: v109.12,7.75 98.38,7.75 97.38,8.75 96.25,8.75 L4.20
  Bottom 0.152: FPC4.2 110.75,7.38 110.38,7.75 v109.12,7.75
FPC4_3  (via drill 0.35)
  Top 0.152: v97,8.12 97.12,8 97.12,7 97.25,6.88 L4.22
  Bottom 0.152: FPC4.3 111.25,6.12 110.88,5.75 100.38,5.75 98,8.12 v97,8.12
FPC4_4  (via drill 0.35)
  Top 0.152: L4.23 v97.75,7.5
  Bottom 0.152: FPC4.4 111.75,6.12 111,5.38 99.88,5.38 v97.75,7.5
FPC4_5  (via drill 0.35)
  Top 0.152: v110.12,8.38 109.75,8 L5.2
  Bottom 0.152: FPC4.5 112.25,7.38 111.25,8.38 v110.12,8.38
FPC4_6  (via drill 0.35)
  Top 0.152: v110.12,4.5 110.25,4.62 L5.3
  Bottom 0.152: FPC4.6 112.75,6.12 111.12,4.5 v110.12,4.5
FPC4_7  (via drill 0.35)
  Top 0.152: v112.12,8.5 111.25,7.62 L5.5
  Bottom 0.152: FPC4.7 113.25,7.38 v112.12,8.5
FPC4_8  (via drill 0.35)
  Top 0.152: v112.25,4.5 111.75,5 L5.6
  Bottom 0.152: FPC4.8 113.75,6 v112.25,4.5
FPC4_9  (via drill 0.35)
  Top 0.152: v113.12,8.5 112.75,8.12 L5.8
  Bottom 0.152: FPC4.9 114.25,7.38 v113.12,8.5
FPC4_10  (via drill 0.35)
  Top 0.152: v113.88,4.75 113.25,5.38 L5.9
  Bottom 0.152: FPC4.10 114.75,5.62 v113.88,4.75
FPC4_11  (via drill 0.35)
  Top 0.152: v114.88,4.75 114.25,5.38 L5.11
  Bottom 0.152: FPC4.11 115.25,5.12 v114.88,4.75
FPC4_12  (via drill 0.35)
  Top 0.152: L5.12 v114.75,8.38
  Bottom 0.152: FPC4.12 115.75,7.38 v114.75,8.38
FPC4_13  (via drill 0.35)
  Top 0.152: v115.88,4.75 115.25,5.38 L5.13
  Bottom 0.152: FPC4.13 116.25,5.12 v115.88,4.75
FPC4_14  (via drill 0.35)
  Top 0.152: L5.14 v115.75,8.62
  Bottom 0.152: FPC4.14 116.75,7.62 v115.75,8.62
FPC4_15  (via drill 0.35)
  Top 0.152: v117,4.75 116.75,5 L5.16
  Bottom 0.152: FPC4.15 117.25,5 v117,4.75
FPC4_16  (via drill 0.35)
  Top 0.152: L5.17 v117.25,8
  Bottom 0.152: FPC4.16 117.75,7.5 v117.25,8
FPC4_17  (via drill 0.35)
  Top 0.152: L5.19 v118.25,4.75
  Bottom 0.152: v118.25,4.75 FPC4.17
FPC4_18  (via drill 0.35)
  Top 0.152: L5.20 v118.75,8
  Bottom 0.152: v118.75,8 FPC4.18
FPC4_19  (via drill 0.35)
  Top 0.152: v119.62,4.75 119.75,4.88 L5.22
  Bottom 0.152: FPC4.19 119.25,5.12 v119.62,4.75
FPC4_20  (via drill 0.35)
  Top 0.152: v120.5,7.5 120.25,7.25 L5.23
  Bottom 0.152: v120.5,7.5 FPC4.20
FPC5_1  (via drill 0.35)
  Top 0.152: v19.62,29 19.75,28.88 L6.2
  Bottom 0.152: FPC5.1 20.25,28.38 v19.62,29
FPC5_2  (via drill 0.35)
  Top 0.152: v20.75,29.25 20.25,28.75 L6.3
  Bottom 0.152: v20.75,29.25 FPC5.2
FPC5_3  (via drill 0.35)
  Top 0.152: L6.5 v21.25,26
  Bottom 0.152: v21.25,26 FPC5.3
FPC5_4  (via drill 0.35)
  Top 0.152: L6.6 v21.75,29.25
  Bottom 0.152: v21.75,29.25 FPC5.4
FPC5_5  (via drill 0.35)
  Top 0.152: v22.25,26 22.75,26.5 L6.8
  Bottom 0.152: v22.25,26 FPC5.5
FPC5_6  (via drill 0.35)
  Top 0.152: v23,29.25 23.25,29 L6.9
  Bottom 0.152: FPC5.6 22.75,29 v23,29.25
FPC5_7  (via drill 0.35)
  Top 0.152: L6.11 v24.25,26
  Bottom 0.152: FPC5.7 23.25,27 v24.25,26
FPC5_8  (via drill 0.35)
  Top 0.152: v24.38,29.25 24.75,28.88 L6.12
  Bottom 0.152: FPC5.8 23.75,28.62 v24.38,29.25
FPC5_9  (via drill 0.35)
  Top 0.152: L6.13 v25.25,26
  Bottom 0.152: FPC5.9 24.25,27 v25.25,26
FPC5_10  (via drill 0.35)
  Top 0.152: v26.25,25.88 25.75,26.38 L6.14
  Bottom 0.152: FPC5.10 24.75,27.38 v26.25,25.88
FPC5_11  (via drill 0.35)
  Top 0.152: v25.88,29.38 26.75,28.5 L6.16
  Bottom 0.152: FPC5.11 25.25,28.75 v25.88,29.38
FPC5_12  (via drill 0.35)
  Top 0.152: L6.17 v27.25,25.88
  Bottom 0.152: FPC5.12 25.75,27.38 v27.25,25.88
FPC5_13  (via drill 0.35)
  Top 0.152: v28.38,25.62 28.25,25.75 L6.19
  Bottom 0.152: FPC5.13 26.25,27.38 27.12,26.5 27.5,26.5 v28.38,25.62
FPC5_14  (via drill 0.35)
  Top 0.152: L6.20 v28.75,29.25
  Bottom 0.152: FPC5.14 26.75,29.25 28.38,30.88 28.88,30.88 29.25,30.5 29.25,29.75 v28.75,29.25
FPC5_15  (via drill 0.35)
  Top 0.152: L6.22 v29.75,26
  Bottom 0.152: FPC5.15 27.25,27.38 28.38,26.25 29.5,26.25 v29.75,26
FPC5_16  (via drill 0.35)
  Top 0.152: v28.62,30.25 30.25,28.62 L6.23
  Bottom 0.152: FPC5.16 27.75,29.38 v28.62,30.25
FPC5_17  (via drill 0.35)
  Top 0.152: L7.2 v42.25,28.75
  Bottom 0.152: FPC5.17 28.25,27.38 29,26.62 40.12,26.62 v42.25,28.75
FPC5_18  (via drill 0.35)
  Top 0.152: v41.38,29.25 41.88,29.25 42,29.38 42.88,29.38 42.88,28.25 42.75,28.12 L7.3
  Bottom 0.152: FPC5.18 28.75,27.38 29.12,27 39.25,27 41.38,29.12 v41.38,29.25
FPC5_19  (via drill 0.35)
  Top 0.152: v40.12,29.25 41.25,28.12 41.25,26.62 42,25.88 43.75,25.88 L7.5
  Bottom 0.152: FPC5.19 29.25,28.62 29.88,29.25 v40.12,29.25
FPC5_20  (via drill 0.35)
  Top 0.152: v43.88,28.75 44.25,28.38 L7.6
  Bottom 0.152: FPC5.20 39.75,28 40.75,29 40.75,29.5 41.12,29.88 42.75,29.88 v43.88,28.75
FPC6_1  (via drill 0.35)
  Top 0.152: v45.75,26 45.25,26.5 L7.8
  Bottom 0.152: FPC6.1 47.75,28 v45.75,26
FPC6_2  (via drill 0.35)
  Top 0.152: v45.62,29.38 45.75,29.25 L7.9
  Bottom 0.152: FPC6.2 50.75,28.62 50,29.38 v45.62,29.38
FPC6_3  (via drill 0.35)
  Top 0.152: v49.88,30 46.75,30 L7.11
  Bottom 0.152: FPC6.3 51.25,28.62 v49.88,30
FPC6_4  (via drill 0.35)
  Top 0.152: v47.5,26 47.25,26.25 L7.12
  Bottom 0.152: FPC6.4 51.75,27.38 50.75,26.38 47.88,26.38 v47.5,26
FPC6_5  (via drill 0.35)
  Top 0.152: v47.38,28.75 47.75,28.38 L7.13
  Bottom 0.152: FPC6.5 52.25,27.38 50.88,26 48.38,26 47.75,25.38 45.5,25.38 45.12,25.75 45.12,26.5 v47.38,28.75
FPC6_6  (via drill 0.35)
  Top 0.152: v48.5,28.75 48.25,28.5 L7.14
  Route2 0.152: v51.75,26 51.25,26 v48.5,28.75
  Bottom 0.152: FPC6.6 52.75,27 v51.75,26
FPC6_7  (via drill 0.35)
  Top 0.152: v49.5,28.75 49.25,28.5 L7.16
  Route2 0.152: v53.25,26 52.62,26 49.88,28.75 v49.5,28.75
  Bottom 0.152: v53.25,26 FPC6.7
FPC6_8  (via drill 0.35)
  Top 0.152: v54,26.75 54,24.5 53.5,24 49.75,24 L7.17
  Bottom 0.152: FPC6.8 53.75,27 v54,26.75
FPC6_9  (via drill 0.35)
  Top 0.152: v51.12,29.62 50.75,29.25 L7.19
  Bottom 0.152: FPC6.9 54.25,28.62 53.25,29.62 v51.12,29.62
FPC6_10  (via drill 0.35)
  Top 0.152: v51,25.38 51.12,25.5 51.12,26.5 51.25,26.62 L7.20
  Bottom 0.152: FPC6.10 54.75,26.62 53.5,25.38 v51,25.38
FPC6_11  (via drill 0.35)
  Top 0.152: v52.88,30.25 52.25,29.62 L7.22
  Bottom 0.152: FPC6.11 55.25,28.62 53.62,30.25 v52.88,30.25
FPC6_12  (via drill 0.35)
  Top 0.152: v53.38,24.75 52.62,25.5 52.62,26.5 52.75,26.62 L7.23
  Bottom 0.152: FPC6.12 55.75,27.12 v53.38,24.75
FPC6_13  (via drill 0.35)
  Top 0.152: v56.25,29.25 64.75,29.25 L8.2
  Bottom 0.152: v56.25,29.25 FPC6.13
FPC6_14  (via drill 0.35)
  Top 0.152: v65,25.38 65.25,25.62 L8.3
  Bottom 0.152: FPC6.14 56.75,27.38 58.75,25.38 v65,25.38
FPC6_15  (via drill 0.35)
  Top 0.152: v66.38,29.38 66.25,29.25 L8.5
  Bottom 0.152: FPC6.15 57.25,28.62 58,29.38 v66.38,29.38
FPC6_16  (via drill 0.35)
  Top 0.152: v66.38,26 66.75,26.38 L8.6
  Bottom 0.152: FPC6.16 57.75,27.38 59.12,26 v66.38,26
FPC6_17  (via drill 0.35)
  Top 0.152: v67.38,26 67.75,26.38 L8.8
  Bottom 0.152: FPC6.17 58.25,27.38 59,26.62 66.75,26.62 v67.38,26
FPC6_18  (via drill 0.35)
  Top 0.152: v68.12,28.75 68.25,28.62 L8.9
  Bottom 0.152: FPC6.18 58.75,27.38 59.12,27 66.38,27 v68.12,28.75
FPC6_19  (via drill 0.35)
  Top 0.152: v60.5,28.38 65,23.88 65,22.12 66.12,21 70,21 70,24.12 69.38,24.75 69.38,26.5 69.25,26.62 L8.11
  Bottom 0.152: FPC6.19 59.25,28.62 59.62,29 59.88,29 v60.5,28.38
FPC6_20  (via drill 0.35)
  Top 0.152: v67.88,29.75 69.62,29.75 69.62,28.25 69.75,28.12 L8.12
  Bottom 0.152: FPC6.20 60,28 60.25,27.75 65.88,27.75 v67.88,29.75
FPC7_1  (via drill 0.35)
  Top 0.152: L8.13 v70.25,28.75
  Route2 0.152: v76.5,28 71,28 v70.25,28.75
  Bottom 0.152: v76.5,28 FPC7.1
FPC7_2  (via drill 0.35)
  Top 0.152: v72.12,29.75 70.75,28.38 L8.14
  Bottom 0.152: FPC7.2 80.75,27.38 80.38,27 74.88,27 v72.12,29.75
FPC7_3  (via drill 0.35)
  Top 0.152: v72,28.75 71.75,28.5 L8.16
  Bottom 0.152: FPC7.3 81.25,27.38 80.5,26.62 74.12,26.62 v72,28.75
FPC7_4  (via drill 0.35)
  Top 0.152: v81.75,26.75 79.75,24.75 72.25,24.75 L8.17
  Bottom 0.152: v81.75,26.75 FPC7.4
FPC7_5  (via drill 0.35)
  Top 0.152: v74.12,29 73.25,28.12 L8.19
  Bottom 0.152: FPC7.5 82.25,28.62 81.88,29 v74.12,29
FPC7_6  (via drill 0.35)
  Top 0.152: v79.25,25.38 73.62,25.38 73.62,26.5 73.75,26.62 L8.20
  Bottom 0.152: FPC7.6 82.75,26.75 81.38,25.38 v79.25,25.38
FPC7_7  (via drill 0.35)
  Top 0.152: v82,29.88 74.75,29.88 L8.22
  Bottom 0.152: FPC7.7 83.25,28.62 v82,29.88
FPC7_8  (via drill 0.35)
  Top 0.152: v83.75,29.25 75.25,29.25 L8.23
  Bottom 0.152: v83.75,29.25 FPC7.8
FPC7_9  (via drill 0.35)
  Top 0.152: v86.62,31 87.25,30.38 L9.2
  Bottom 0.152: FPC7.9 84.25,28.62 v86.62,31
FPC7_10  (via drill 0.35)
  Top 0.152: v86.62,24.12 87.62,25.12 87.62,26.5 87.75,26.62 L9.3
  Bottom 0.152: FPC7.10 84.75,26 v86.62,24.12
FPC7_11  (via drill 0.35)
  Top 0.152: v88.25,24.75 88.88,25.38 88.88,26.5 88.75,26.62 L9.5
  Bottom 0.152: FPC7.11 85.25,26.12 86.62,24.75 v88.25,24.75
FPC7_12  (via drill 0.35)
  Top 0.152: v88.88,30.62 89.25,30.25 L9.6
  Bottom 0.152: FPC7.12 85.75,29.25 87.12,30.62 v88.88,30.62
FPC7_13  (via drill 0.35)
  Top 0.152: v90.38,25.38 90.25,25.5 L9.8
  Bottom 0.152: FPC7.13 86.25,26.38 86.12,26.25 86.12,25.75 86.5,25.38 v90.38,25.38
FPC7_14  (via drill 0.35)
  Top 0.152: L9.9 v90.75,28.75
  Route2 0.152: v86.62,29.25 89,29.25 89.62,29.88 90.12,29.88 90.75,29.25 v90.75,28.75
  Bottom 0.152: FPC7.14 86.75,29.12 v86.62,29.25
FPC7_15  (via drill 0.35)
  Top 0.152: v89.88,30.62 91.5,29 91.5,28.38 91.75,28.12 L9.11
  Bottom 0.152: FPC7.15 87.25,28.62 88.62,30 89.25,30 v89.88,30.62
FPC7_16  (via drill 0.35)
  Top 0.152: v92.12,28.75 92.25,28.62 L9.12
  Bottom 0.152: FPC7.16 87.75,28.62 88.75,29.62 89.38,29.62 89.62,29.88 91,29.88 v92.12,28.75
FPC7_17  (via drill 0.35)
  Top 0.152: v92.5,26 92.75,26.25 L9.13
  Route2 0.152: v89.88,29.25 89.88,28.62 v92.5,26
  Bottom 0.152: FPC7.17 88.25,28.62 88.88,29.25 v89.88,29.25
FPC7_18  (via drill 0.35)
  Top 0.152: v94.88,30.62 93.25,29 L9.14
  Bottom 0.152: FPC7.18 88.75,27.38 89.5,26.62 93,26.62 95.38,29 95.38,30.12 v94.88,30.62
FPC7_19  (via drill 0.35)
  Top 0.152: L9.16 v94.25,28.75
  Bottom 0.152: FPC7.19 89.25,27.38 89.62,27 92.5,27 v94.25,28.75
FPC7_20  (via drill 0.35)
  Top 0.152: v94.75,29.62 94.88,29.5 94.88,28.25 94.75,28.12 L9.17
  Bottom 0.152: FPC7.20 92.62,28 94.25,29.62 v94.75,29.62
FPC8_1  (via drill 0.35)
  Top 0.152: v96.12,28.75 95.75,28.38 L9.19
  Bottom 0.152: FPC8.1 96.88,28 v96.12,28.75
FPC8_2  (via drill 0.35)
  Top 0.152: v96.5,26 96.25,26.25 L9.20
  Bottom 0.152: FPC8.2 110.75,27.38 110.38,27 109,27 108.75,27.25 97.75,27.25 v96.5,26
FPC8_3  (via drill 0.35)
  Top 0.152: v106.38,29.25 97.25,29.25 L9.22
  Bottom 0.152: FPC8.3 111.25,28.62 110.62,29.25 v106.38,29.25
FPC8_4  (via drill 0.35)
  Top 0.152: v104.12,28.62 97.75,28.62 L9.23
  Bottom 0.152: FPC8.4 111.75,28.62 110.5,29.88 106.62,29.88 106.38,30.12 105.62,30.12 v104.12,28.62
FPC8_5  (via drill 0.35)
  Top 0.152: v108.5,26.62 108.75,26.88 108.75,28.12 109.12,28.5 109.75,28.5 L10.2
  Bottom 0.152: FPC8.5 112.25,27.38 111.5,26.62 v108.5,26.62
FPC8_6  (via drill 0.35)
  Top 0.152: v110.12,26 110.25,26.12 L10.3
  Route2 0.152: v112.88,29.25 112.88,28.75 v110.12,26
  Bottom 0.152: FPC8.6 112.75,29.12 v112.88,29.25
FPC8_7  (via drill 0.35)
  Top 0.152: v111.62,29.88 111.25,29.5 L10.5
  Bottom 0.152: FPC8.7 113.25,28.75 113.5,29 113.5,29.5 113.12,29.88 v111.62,29.88
FPC8_8  (via drill 0.35)
  Top 0.152: v112.12,26 111.75,26.38 L10.6
  Bottom 0.152: FPC8.8 113.75,27.38 113,26.62 112.75,26.62 v112.12,26
FPC8_9  (via drill 0.35)
  Top 0.152: v113.12,26 112.75,26.38 L10.8
  Bottom 0.152: FPC8.9 114.25,27.12 v113.12,26
FPC8_10  (via drill 0.35)
  Top 0.152: v114.25,29.25 113.25,28.25 L10.9
  Bottom 0.152: FPC8.10 114.75,28.75 v114.25,29.25
FPC8_11  (via drill 0.35)
  Top 0.152: v114.62,26 114.25,26.38 L10.11
  Bottom 0.152: FPC8.11 115.25,26.62 v114.62,26
FPC8_12  (via drill 0.35)
  Top 0.152: v115.25,29.25 114.75,28.75 L10.12
  Bottom 0.152: FPC8.12 115.75,28.75 v115.25,29.25
FPC8_13  (via drill 0.35)
  Top 0.152: v115.62,26 115.25,26.38 L10.13
  Bottom 0.152: FPC8.13 116.25,26.62 v115.62,26
FPC8_14  (via drill 0.35)
  Top 0.152: v116.25,29.25 115.75,28.75 L10.14
  Bottom 0.152: FPC8.14 116.75,28.75 v116.25,29.25
FPC8_15  (via drill 0.35)
  Top 0.152: v117.25,26 116.75,26.5 L10.16
  Bottom 0.152: v117.25,26 FPC8.15
FPC8_16  (via drill 0.35)
  Top 0.152: L10.17 v117.25,29.25
  Bottom 0.152: FPC8.16 117.75,28.75 v117.25,29.25
FPC8_17  (via drill 0.35)
  Top 0.152: L10.19 v118.25,26
  Bottom 0.152: v118.25,26 FPC8.17
FPC8_18  (via drill 0.35)
  Top 0.152: L10.20 v118.75,29.25
  Bottom 0.152: v118.75,29.25 FPC8.18
FPC8_19  (via drill 0.35)
  Top 0.152: v119.62,26 119.75,26.12 L10.22
  Bottom 0.152: FPC8.19 119.25,26.38 v119.62,26
FPC8_20  (via drill 0.35)
  Top 0.152: v120.5,28.75 120.25,28.5 L10.23
  Bottom 0.152: v120.5,28.75 FPC8.20
FPC9_1  (via drill 0.35)
  Top 0.152: v19.25,50.25 19.75,49.75 L11.2
  Bottom 0.152: v19.25,50.25 FPC9.1
FPC9_2  (via drill 0.35)
  Top 0.152: L11.3 v20.25,50.5
  Bottom 0.152: FPC9.2 20.75,50 v20.25,50.5
FPC9_3  (via drill 0.35)
  Top 0.152: L11.5 v21.25,47.25
  Bottom 0.152: v21.25,47.25 FPC9.3
FPC9_4  (via drill 0.35)
  Top 0.152: L11.6 v21.75,50.5
  Bottom 0.152: v21.75,50.5 FPC9.4
FPC9_5  (via drill 0.35)
  Top 0.152: v22.62,47.25 22.75,47.38 L11.8
  Bottom 0.152: FPC9.5 22.25,47.62 v22.62,47.25
FPC9_6  (via drill 0.35)
  Top 0.152: v23,50.5 23.25,50.25 L11.9
  Bottom 0.152: FPC9.6 22.75,50.25 v23,50.5
FPC9_7  (via drill 0.35)
  Top 0.152: L11.11 v24.25,47.25
  Bottom 0.152: FPC9.7 23.25,48.25 v24.25,47.25
FPC9_8  (via drill 0.35)
  Top 0.152: v24.38,50.5 24.75,50.12 L11.12
  Bottom 0.152: FPC9.8 23.75,49.88 v24.38,50.5
FPC9_9  (via drill 0.35)
  Top 0.152: L11.13 v25.25,47.25
  Bottom 0.152: FPC9.9 24.25,48.25 v25.25,47.25
FPC9_10  (via drill 0.35)
  Top 0.152: v26.25,47.12 25.75,47.62 L11.14
  Bottom 0.152: FPC9.10 24.75,48.62 v26.25,47.12
FPC9_11  (via drill 0.35)
  Top 0.152: v25.88,50.62 26.75,49.75 L11.16
  Bottom 0.152: FPC9.11 25.25,50 v25.88,50.62
FPC9_12  (via drill 0.35)
  Top 0.152: L11.17 v27.25,47.12
  Bottom 0.152: FPC9.12 25.75,48.62 v27.25,47.12
FPC9_13  (via drill 0.35)
  Top 0.152: v28.38,46.88 28.25,47 L11.19
  Bottom 0.152: FPC9.13 26.25,48.62 27.12,47.75 27.5,47.75 v28.38,46.88
FPC9_14  (via drill 0.35)
  Top 0.152: L11.20 v28.75,50.5
  Route2 0.152: v28.75,50.5 v27.12,50.5
  Bottom 0.152: FPC9.14 26.75,50.12 v27.12,50.5
FPC9_15  (via drill 0.35)
  Top 0.152: L11.22 v29.75,47.25
  Bottom 0.152: FPC9.15 27.25,48.62 28.38,47.5 29.5,47.5 v29.75,47.25
FPC9_16  (via drill 0.35)
  Top 0.152: v29.5,51.12 30.25,50.38 L11.23
  Bottom 0.152: FPC9.16 27.75,50.38 28.5,51.12 v29.5,51.12
FPC9_17  (via drill 0.35)
  Top 0.152: v38.88,47.88 41.25,47.88 41.25,49.38 41.62,49.75 42.25,49.75 L12.2
  Bottom 0.152: FPC9.17 28.25,48.62 29,47.88 v38.88,47.88
FPC9_18  (via drill 0.35)
  Top 0.152: v39.62,49.5 40.38,50.25 42.75,50.25 L12.3
  Bottom 0.152: FPC9.18 28.75,48.62 29.12,48.25 38.38,48.25 v39.62,49.5
FPC9_19  (via drill 0.35)
  Top 0.152: v43.88,50.25 43.75,50.12 L12.5
  Bottom 0.152: FPC9.19 29.25,49.88 29.62,50.25 v43.88,50.25
FPC9_20  (via drill 0.35)
  Top 0.152: v32.62,49.25 36,49.25 38.12,47.12 44.25,47.12 L12.6
  Bottom 0.152: v32.62,49.25 FPC9.20
FPC10_1  (via drill 0.35)
  Top 0.152: v45.88,47.25 45.25,47.88 L12.8
  Bottom 0.152: FPC10.1 47.88,49.25 v45.88,47.25
FPC10_2  (via drill 0.35)
  Top 0.152: v45.62,50.62 45.75,50.5 L12.9
  Bottom 0.152: FPC10.2 50.75,49.88 50,50.62 v45.62,50.62
FPC10_3  (via drill 0.35)
  Top 0.152: v46.88,51.25 46.75,51.12 L12.11
  Bottom 0.152: FPC10.3 51.25,49.88 50,51.12 47,51.12 v46.88,51.25
FPC10_4  (via drill 0.35)
  Top 0.152: v47.88,47.25 47.25,47.88 L12.12
  Bottom 0.152: FPC10.4 51.75,48.62 50.38,47.25 v47.88,47.25
FPC10_5  (via drill 0.35)
  Top 0.152: v47.38,50 47.75,49.62 L12.13
  Bottom 0.152: FPC10.5 52.25,48.62 50.25,46.62 45.5,46.62 45.12,47 45.12,47.75 v47.38,50
FPC10_6  (via drill 0.35)
  Top 0.152: v48.5,50 48.25,49.75 L12.14
  Route2 0.152: v51.75,47.25 51.25,47.25 v48.5,50
  Bottom 0.152: FPC10.6 52.75,48.25 v51.75,47.25
FPC10_7  (via drill 0.35)
  Top 0.152: v49.5,50 49.25,49.75 L12.16
  Route2 0.152: v53.25,47.25 52.62,47.25 49.88,50 v49.5,50
  Bottom 0.152: v53.25,47.25 FPC10.7
FPC10_8  (via drill 0.35)
  Top 0.152: v54,48 53.88,47.88 53.88,47 52.88,46 49.75,46 L12.17
  Bottom 0.152: FPC10.8 53.75,48.25 v54,48
FPC10_9  (via drill 0.35)
  Top 0.152: v51.12,50.88 50.75,50.5 L12.19
  Bottom 0.152: FPC10.9 54.25,49.88 53.25,50.88 v51.12,50.88
FPC10_10  (via drill 0.35)
  Top 0.152: v52.5,46.62 51.12,46.62 51.12,47.75 51.25,47.88 L12.20
  Bottom 0.152: FPC10.10 54.75,47.88 53.5,46.62 v52.5,46.62
FPC10_11  (via drill 0.35)
  Top 0.152: v54.88,50.5 54.25,51.12 54.25,51.62 53.88,52 52.25,52 L12.22
  Bottom 0.152: FPC10.11 55.25,50.12 v54.88,50.5
FPC10_12  (via drill 0.35)
  Top 0.152: v53.62,51.38 52.75,50.5 L12.23
  Bottom 0.152: FPC10.12 55.75,50.5 54.88,51.38 v53.62,51.38
FPC10_13  (via drill 0.35)
  Top 0.152: v64.62,46.75 64.75,46.88 L13.2
  Bottom 0.152: FPC10.13 56.25,48.62 58.12,46.75 v64.62,46.75
FPC10_14  (via drill 0.35)
  Top 0.152: v65.12,50 65.25,49.88 L13.3
  Bottom 0.152: FPC10.14 56.75,48.62 58.25,47.12 62.25,47.12 v65.12,50
FPC10_15  (via drill 0.35)
  Top 0.152: v66.38,50 66.25,49.88 L13.5
  Bottom 0.152: FPC10.15 57.25,48.62 58.38,47.5 62.12,47.5 64.5,49.88 64.5,50.25 64.88,50.62 65.75,50.62 v66.38,50
FPC10_16  (via drill 0.35)
  Top 0.152: v67,47.25 66.75,47.5 L13.6
  Bottom 0.152: FPC10.16 57.75,48.62 58.5,47.88 62,47.88 64.12,50 64.12,50.38 64.75,51 66.25,51 67,50.25 v67,47.25
FPC10_17  (via drill 0.35)
  Top 0.152: v67.88,50 67.75,49.88 L13.8
  Bottom 0.152: FPC10.17 58.25,48.62 58.62,48.25 61.88,48.25 63.75,50.12 63.75,50.5 64.62,51.38 66.5,51.38 v67.88,50
FPC10_18  (via drill 0.35)
  Top 0.152: v67.88,51 68.5,50.38 68.5,49.62 68.25,49.38 L13.9
  Bottom 0.152: FPC10.18 58.75,49.88 60,51.12 63.88,51.12 64.5,51.75 67.12,51.75 v67.88,51
FPC10_19  (via drill 0.35)
  Top 0.152: v69.12,50 69.25,49.88 L13.11
  Route2 0.152: v63.12,50.38 63.88,50.38 64.88,49.38 68.5,49.38 v69.12,50
  Bottom 0.152: FPC10.19 59.25,49.88 59.75,50.38 v63.12,50.38
FPC10_20  (via drill 0.35)
  Top 0.152: v62.38,49.62 63.5,48.5 63.5,47 65.12,45.38 68.75,45.38 68.75,43.38 69,43.12 70,43.12 70,47.62 69.75,47.88 L13.12
  Bottom 0.152: FPC10.20 62,49.25 v62.38,49.62
FPC11_1  (via drill 0.35)
  Top 0.152: v72.12,51 70.25,51 L13.13
  Route2 0.152: v76,50 75,51 v72.12,51
  Bottom 0.152: FPC11.1 76.75,49.25 v76,50
FPC11_2  (via drill 0.35)
  Top 0.152: v72.12,50 70.75,50 L13.14
  Bottom 0.152: FPC11.2 80.75,48.62 80.38,48.25 77,48.25 76,49.25 72.88,49.25 v72.12,50
FPC11_3  (via drill 0.35)
  Top 0.152: v72.75,46.62 71.75,46.62 L13.16
  Route2 0.152: v76.5,47.88 74,47.88 v72.75,46.62
  Bottom 0.152: FPC11.3 81.25,48.62 80.5,47.88 v76.5,47.88
FPC11_4  (via drill 0.35)
  Top 0.152: v77.88,45.62 73.38,45.62 73.38,46.88 72.75,47.5 72.25,47.5 L13.17
  Route2 0.152: v81.88,48 80.25,48 v77.88,45.62
  Bottom 0.152: FPC11.4 81.75,48.12 v81.88,48
FPC11_5  (via drill 0.35)
  Top 0.152: v73.38,50 73.25,49.88 L13.19
  Bottom 0.152: FPC11.5 82.25,49.88 81.5,50.62 75.75,50.62 75.38,50.25 75.38,50 75,49.62 73.75,49.62 v73.38,50
FPC11_6  (via drill 0.35)
  Top 0.152: v80.88,47.25 77.25,50.88 74,50.88 74,49.62 73.75,49.38 L13.20
  Bottom 0.152: FPC11.6 82.75,48 82,47.25 v80.88,47.25
FPC11_7  (via drill 0.35)
  Top 0.152: L13.22 v74.75,50.25
  Bottom 0.152: FPC11.7 83.25,49.88 82.12,51 75.5,51 v74.75,50.25
FPC11_8  (via drill 0.35)
  Top 0.152: v81.5,46.25 75.12,46.25 75.12,47.75 75.25,47.88 L13.23
  Bottom 0.152: FPC11.8 83.75,48.5 v81.5,46.25
FPC11_9  (via drill 0.35)
  Top 0.152: v84.25,47.75 86.38,47.75 86.62,47.5 87.25,47.5 L14.2
  Bottom 0.152: v84.25,47.75 FPC11.9
FPC11_10  (via drill 0.35)
  Top 0.152: v85.88,47.12 87.75,47.12 L14.3
  Bottom 0.152: FPC11.10 84.75,48.25 v85.88,47.12
FPC11_11  (via drill 0.35)
  Top 0.152: v87.38,46.5 88.75,46.5 L14.5
  Bottom 0.152: FPC11.11 85.25,48.62 v87.38,46.5
FPC11_12  (via drill 0.35)
  Top 0.152: v88,52.12 89.25,50.88 L14.6
  Bottom 0.152: FPC11.12 85.75,49.88 v88,52.12
FPC11_13  (via drill 0.35)
  Top 0.152: v89.62,46 90.25,46.62 L14.8
  Bottom 0.152: FPC11.13 86.25,48.62 88.88,46 v89.62,46
FPC11_14  (via drill 0.35)
  Top 0.152: v90.88,46.62 90.75,46.75 L14.9
  Bottom 0.152: FPC11.14 86.75,48.62 88.75,46.62 v90.88,46.62
FPC11_15  (via drill 0.35)
  Top 0.152: v89.25,51.88 91.75,49.38 L14.11
  Bottom 0.152: FPC11.15 87.25,49.88 v89.25,51.88
FPC11_16  (via drill 0.35)
  Top 0.152: v92.12,50.62 92.25,50.5 L14.12
  Bottom 0.152: FPC11.16 87.75,49.88 88.5,50.62 v92.12,50.62
FPC11_17  (via drill 0.35)
  Top 0.152: v92.38,47.25 92.75,47.62 L14.13
  Bottom 0.152: FPC11.17 88.25,48.62 89.62,47.25 v92.38,47.25
FPC11_18  (via drill 0.35)
  Top 0.152: v93.12,50.62 93.25,50.5 L14.14
  Bottom 0.152: FPC11.18 88.75,49.88 89.12,50.25 91.62,50.25 91.88,50 92.5,50 v93.12,50.62
FPC11_19  (via drill 0.35)
  Top 0.152: L14.16 v94.25,50
  Bottom 0.152: FPC11.19 89.25,48.62 89.62,48.25 92.5,48.25 v94.25,50
FPC11_20  (via drill 0.35)
  Top 0.152: v94.38,51 94.88,50.5 94.88,49.5 94.75,49.38 L14.17